# Altium project PLD.PrjPcb (part 2 of 2)

## Sheet PLD_SunSref-Interface.SchDoc: SunS Ref. Interface
size A4; ApprovedBy: Piotr Kuligowski; CheckedBy: Michal Gumiela; Author: Grzegorz Gajoch; DocumentNumber: PWSat2-xxx-DW-xxx; Revision: 1; SheetTotal: 32; Model: DM1
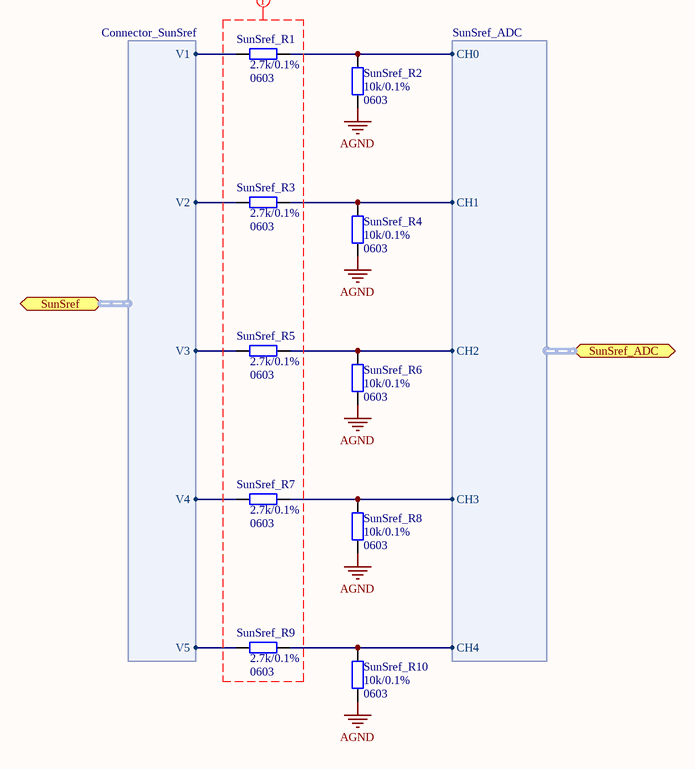
[diagram p16: PLD_SunSref-Interface.SchDoc]

### Parts
SunSref_R1  Package: 0603  [SMD_Resistor_0603]  (hidden comment: 2.7k/0.1%)
SunSref_R2  Package: 0603  [SMD_Resistor_0603]  (hidden comment: 10k/0.1%)
SunSref_R3  Package: 0603  [SMD_Resistor_0603]  (hidden comment: 2.7k/0.1%)
SunSref_R4  Package: 0603  [SMD_Resistor_0603]  (hidden comment: 10k/0.1%)
SunSref_R5  Package: 0603  [SMD_Resistor_0603]  (hidden comment: 2.7k/0.1%)
SunSref_R6  Package: 0603  [SMD_Resistor_0603]  (hidden comment: 10k/0.1%)
SunSref_R7  Package: 0603  [SMD_Resistor_0603]  (hidden comment: 2.7k/0.1%)
SunSref_R8  Package: 0603  [SMD_Resistor_0603]  (hidden comment: 10k/0.1%)
SunSref_R9  Package: 0603  [SMD_Resistor_0603]  (hidden comment: 2.7k/0.1%)
SunSref_R10  Package: 0603  [SMD_Resistor_0603]  (hidden comment: 10k/0.1%)

### Ports
SunSref (harness Connector_SunSref), SunSref_ADC (harness SunSref_ADC)

### Harnesses
Connector_SunSref: V1, V2, V3, V4, V5
SunSref_ADC: CH0, CH1, CH2, CH3, CH4

### Nets
AGND: SunSref_R2.1 SunSref_R4.1 SunSref_R6.1 SunSref_R8.1 SunSref_R10.1
NetADC_C1_1: SunSref_R1.2 SunSref_R2.2 ; port SunSref_ADC.CH0
NetADC_C2_1: SunSref_R9.2 SunSref_R10.2 ; port SunSref_ADC.CH4
NetADC_C3_1: SunSref_R3.2 SunSref_R4.2 ; port SunSref_ADC.CH1
NetADC_C4_1: SunSref_R7.2 SunSref_R8.2 ; port SunSref_ADC.CH3
NetADC_C6_1: SunSref_R5.2 SunSref_R6.2 ; port SunSref_ADC.CH2
NetCONN_H1_1: SunSref_R7.1 ; port SunSref.V4
NetCONN_H1_2: SunSref_R5.1 ; port SunSref.V3
NetCONN_H1_4: SunSref_R1.1 ; port SunSref.V1
NetCONN_H1_6: SunSref_R3.1 ; port SunSref.V2
NetCONN_H1_7: SunSref_R9.1 ; port SunSref.V5

### Layout directives
net class SunS-ref: (no net found under the mark)

### Notes on the sheet
- Title:
- Project:
- Author:
- Model:
- Document Number:
- Checked by:
- Rev:
- Date:
- Approved by:
- Sheet:
- of
- File name:

### Library data of the parts
SunSref_R1-SunSref_R10 = Res
  SunSref_R1 SunSref_R3 SunSref_R5 SunSref_R7 SunSref_R9: Value: 2.7k/0.1%
  SunSref_R2 SunSref_R4 SunSref_R6 SunSref_R8 SunSref_R10: Value: 10k/0.1%

## Sheet PLD_ADC.SchDoc: ADC for SunSref,Photodiodes and HK
size A4; ApprovedBy: Piotr Kuligowski; CheckedBy: Michal Gumiela; Author: Grzegorz Gajoch; DocumentNumber: PWSat2-xxx-DW-xxx; Revision: 1; SheetTotal: 32; Model: DM1
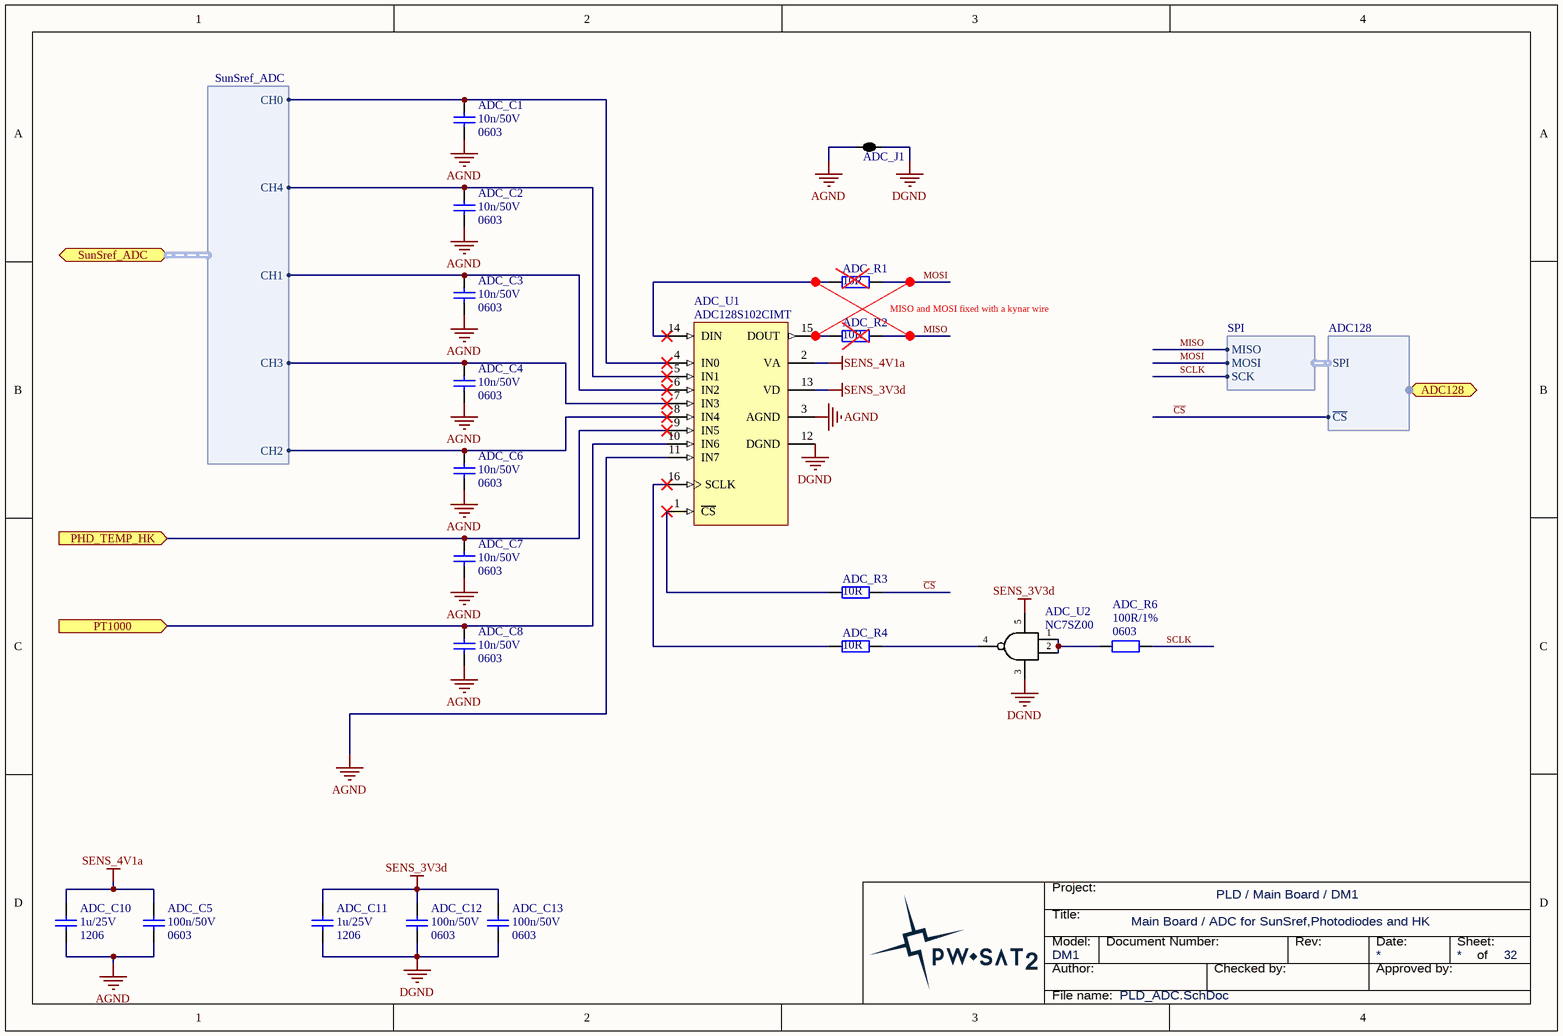
[diagram p17: PLD_ADC.SchDoc]

### Parts
ADC_C1  value 10n/50V  Package: 0603  [SMD_Capacitor_0603]  (hidden comment: Cap)
ADC_C2  value 10n/50V  Package: 0603  [SMD_Capacitor_0603]  (hidden comment: Cap)
ADC_C3  value 10n/50V  Package: 0603  [SMD_Capacitor_0603]  (hidden comment: Cap)
ADC_C4  value 10n/50V  Package: 0603  [SMD_Capacitor_0603]  (hidden comment: Cap)
ADC_C5  Package: 0603  [SMD_Capacitor_0603]  (hidden comment: 100n/50V)
ADC_C6  value 10n/50V  Package: 0603  [SMD_Capacitor_0603]  (hidden comment: Cap)
ADC_C7  value 10n/50V  Package: 0603  [SMD_Capacitor_0603]  (hidden comment: Cap)
ADC_C8  value 10n/50V  Package: 0603  [SMD_Capacitor_0603]  (hidden comment: Cap)
ADC_C10  Package: 1206  [SMD_Capacitor_1206]  (hidden comment: 1u/25V)
ADC_C11  Package: 1206  [SMD_Capacitor_1206]  (hidden comment: 1u/25V)
ADC_C12  Package: 0603  [SMD_Capacitor_0603]  (hidden comment: 100n/50V)
ADC_C13  Package: 0603  [SMD_Capacitor_0603]  (hidden comment: 100n/50V)
ADC_J1  2 way net tie junction  [2way_LP]  (value not drawn)  (net tie, no BOM)
ADC_R1  10R  [SMD_Resistor_0603]
ADC_R2  10R  [SMD_Resistor_0603]
ADC_R3  10R  [SMD_Resistor_0603]
ADC_R4  10R  [SMD_Resistor_0603]
ADC_R6  Package: 0603  [SMD_Resistor_0603]  (hidden comment: 100R/1%)
ADC_U1  ADC128S102CIMT  [TSSOP16]
ADC_U2  NC7SZ00  [SOT23-5]

### Ports
ADC128 (harness ADC128), PHD_TEMP_HK (in), PT1000 (in), SunSref_ADC (harness SunSref_ADC)

### Harnesses
SPI: MISO, MOSI, SCK
SunSref_ADC: CH0, CH1, CH2, CH3, CH4
ADC128: SPI, ~{CS}

### Nets
AGND: ADC_C1.2 ADC_C2.2 ADC_C3.2 ADC_C4.2 ADC_C5.2 ADC_C6.2 ADC_C7.2 ADC_C8.2 ADC_C10.2 ADC_J1.1 ADC_U1.3(AGND) ADC_U1.11(IN7)
DGND: ADC_C11.2 ADC_C12.2 ADC_C13.2 ADC_J1.2 ADC_U1.12(DGND) ADC_U2.3(GND)
SENS_3V3d: ADC_C11.1 ADC_C12.1 ADC_C13.1 ADC_U1.13(VD) ADC_U2.5(Vcc)
SENS_4V1a: ADC_C5.1 ADC_C10.1 ADC_U1.2(VA)
~{CS}: ADC_R3.2 ; port ADC128.~{CS}  [project net ADC128_~{CS}]
MISO: ADC_R2.2 ; harness SPI.MISO
MOSI: ADC_R1.2 ; harness SPI.MOSI
SCLK: ADC_R6.2 ; harness SPI.SCK  [project net SCK]
NetADC_C1_1: ADC_C1.1 ADC_U1.4(IN0) ; port SunSref_ADC.CH0
NetADC_C2_1: ADC_C2.1 ADC_U1.5(IN1) ; port SunSref_ADC.CH4
NetADC_C3_1: ADC_C3.1 ADC_U1.6(IN2) ; port SunSref_ADC.CH1
NetADC_C4_1: ADC_C4.1 ADC_U1.7(IN3) ; port SunSref_ADC.CH3
NetADC_C6_1: ADC_C6.1 ADC_U1.8(IN4) ; port SunSref_ADC.CH2
NetADC_C7_1: ADC_C7.1 ADC_U1.9(IN5) ; port PHD_TEMP_HK
NetADC_C8_1: ADC_C8.1 ADC_U1.10(IN6) ; port PT1000
NetADC_R1_1: ADC_R1.1 ADC_U1.14(DIN)
NetADC_R2_1: ADC_R2.1 ADC_U1.15(DOUT)
NetADC_R3_1: ADC_R3.1 ADC_U1.1(~{CS})
NetADC_R4_1: ADC_R4.1 ADC_U1.16(SCLK)
NetADC_R4_2: ADC_R4.2 ADC_U2.4(Y)
NetADC_R6_1: ADC_R6.1 ADC_U2.1(A) ADC_U2.2(B)

### Notes on the sheet
- MISO and MOSI fixed with a kynar wire
- Title:
- Project:
- Author:
- Model:
- Document Number:
- Checked by:
- Rev:
- Date:
- Approved by:
- Sheet:
- of
- File name:

### Library data of the parts
ADC_C5 ADC_C12 ADC_C13 = Cer_C0603T104K5RALTU: Ceramic Cap Kemet COTS 100n/50V X7R 0603; Manufacturer: Kemet; ManufacturerPartNumber: C0603T104K5RALTU; Value: 100n/50V
ADC_C10 ADC_C11 = Cer_C1206T105K3RALTU: Ceramic Cap Kemet COTS 1u/25V X7R 1206; ManufacturerPartNumber: C1206T105K3RALTU; Manufacturer: Kemet; Value: 1u/25V
ADC_J1 = 2way: ComponentLink1URL: http://www.edatools.cz/addons; ComponentLink1Description: Source; FootprintNote: LP=12mil, MP=40mil, HP=120mil
ADC_R1-ADC_R4 = Res: Value: 10R; Package: 0603
ADC_R6 = CRCW0603100RFKxxxx: 100R/1% Vishay CRCW 0603 Resistor. 100mW, 100ppm, 75V.; Manufacturer: Vishay; ManufacturerPartNumber: CRCW0603100RFKxxxx; Value: 100R/1%
ADC_U1 = ADC128S102CIMT: 8-Channel, 500-ksps to 1-Msps, 12-Bit A/D Converter; Manufacturer: Texas Instruments; Category: ADC; ManufacturerPartNumber: ADC128S102CIMT
ADC_U2 = NC7SZ00: TinyLogic UHS Two-Input NAND Gate.; Manufacturer: Fairchild Semiconductor; Value: NC7SZ00

## Sheet PLD_I2C-Repeater.SchDoc: I2C Repeater for RadFET
size A4; ApprovedBy: Piotr Kuligowski; CheckedBy: Michal Gumiela; Author: Grzegorz Gajoch; DocumentNumber: PWSat2-xxx-DW-xxx; Revision: 1; SheetTotal: 32; Model: DM1
Used 4 times, as channels PLD Top/I2C Repeater for PLD, PLD Top/I2C Repeater for RTC, PLD Top/I2C Repeater for SunS, PLD Top/I2C Repeater for Gyro. Parts and nets are listed once, with the designators drawn on the sheet.
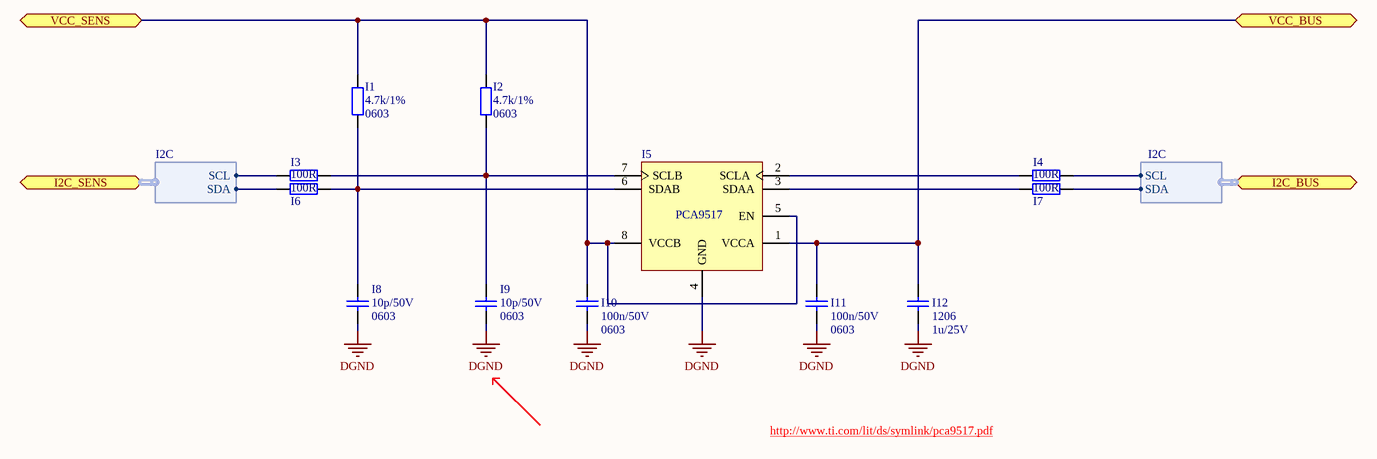
[diagram p18: PLD_I2C-Repeater.SchDoc]

### Parts
I1  Package: 0603  [SMD_Resistor_0603]  (hidden comment: 4.7k/1%)
I2  Package: 0603  [SMD_Resistor_0603]  (hidden comment: 4.7k/1%)
I3  100R  [SMD_Resistor_0603]
I4  100R  [SMD_Resistor_0603]
I5  PCA9517  [TSSOP8_L]
I6  100R  [SMD_Resistor_0603]
I7  100R  [SMD_Resistor_0603]
I8  Package: 0603  [SMD_Capacitor_0603]  (hidden comment: 10p/50V)
I9  Package: 0603  [SMD_Capacitor_0603]  (hidden comment: 10p/50V)
I10  Package: 0603  [SMD_Capacitor_0603]  (hidden comment: 100n/50V)
I11  Package: 0603  [SMD_Capacitor_0603]  (hidden comment: 100n/50V)
I12  Package: 1206  [SMD_Capacitor_1206]  (hidden comment: 1u/25V)

### Ports
I2C_BUS (harness I2C), I2C_SENS (harness I2C), VCC_BUS, VCC_SENS

### Harnesses
I2C: SDA, SCL

### Nets
DGND: I5.4(GND) I8.2 I9.2 I10.1 I11.1 I12.1
VCC_BUS: I5.1(VCCA) I11.2 I12.2 ; port VCC_BUS
VCC_SENS: I1.1 I2.1 I5.5(EN) I5.8(VCCB) I10.2 ; port VCC_SENS
NetI1_2: I1.2 I5.6(SDAB) I6.2 I8.1
NetI2_2: I2.2 I3.2 I5.7(SCLB) I9.1
NetI3_1: I3.1 ; port I2C_SENS.SCL
NetI4_1: I4.1 I5.2(SCLA)
NetI4_2: I4.2 ; port I2C_BUS.SCL
NetI5_3: I5.3(SDAA) I7.1
NetI6_1: I6.1 ; port I2C_SENS.SDA
NetI7_2: I7.2 ; port I2C_BUS.SDA

### Channels
PLD Top/I2C Repeater for PLD: designators end in _I2C_Repeater_for_PLD; ports VCC_BUS=OBC_PLD_3V3 VCC_SENS=SENS_3V3d
PLD Top/I2C Repeater for RTC: designators end in _I2C_Repeater_for_RTC; ports VCC_BUS=OBC_BUS_3V3 VCC_SENS=OBC_BUS_3V3
PLD Top/I2C Repeater for SunS: designators end in _I2C_Repeater_for_SunS; ports VCC_BUS=OBC_PLD_3V3 VCC_SENS=SunS_3V3
PLD Top/I2C Repeater for Gyro: designators end in _I2C_Repeater_for_Gyro; ports VCC_BUS=OBC_PLD_3V3 VCC_SENS=OBC_PLD_3V3

### Notes on the sheet
- http://www.ti.com/lit/ds/symlink/pca9517.pdf
- Title:
- Project:
- Author:
- Model:
- Document Number:
- Checked by:
- Rev:
- Date:
- Approved by:
- Sheet:
- of
- File name:

### Library data of the parts
I1 I2 = CRCW06034K70FKxxxx: 4.7k/1% Vishay CRCW 0603 Resistor. 100mW, 100ppm, 75V.; Manufacturer: Vishay; ManufactuerPartNumber: CRCW06034K70FKxxxx; Value: 4.7k/1%
I3 I4 I6 I7 = Res: Value: 100R; Package: 0603
I5 = PCA9517: Level-Translating I2C Bus Repeater; Manufacturer: Texas Instruments; ManufacturerPartNumber: PCA9517
I8 I9 = Cer_GCM1885C1H100JA16D: Ceramic Cap Murata Automotive 10p/50V C0G 0603; Manufacturer: Murata; ManufacturerPartNumber: GCM1885C1H100JA16D; Value: 10p/50V
I10 I11 = Cer_C0603T104K5RALTU: Ceramic Cap Kemet COTS 100n/50V X7R 0603; Manufacturer: Kemet; ManufacturerPartNumber: C0603T104K5RALTU; Value: 100n/50V
I12 = Cer_C1206T105K3RALTU: Ceramic Cap Kemet COTS 1u/25V X7R 1206; ManufacturerPartNumber: C1206T105K3RALTU; Manufacturer: Kemet; Value: 1u/25V

## Sheet PLD_Gyroscopes.SchDoc: Gyroscopes
size A4; ApprovedBy: Piotr Kuligowski; CheckedBy: Michal Gumiela; Author: Grzegorz Gajoch; DocumentNumber: PWSat2-xxx-DW-xxx; Revision: 1; SheetTotal: 32; Model: DM1
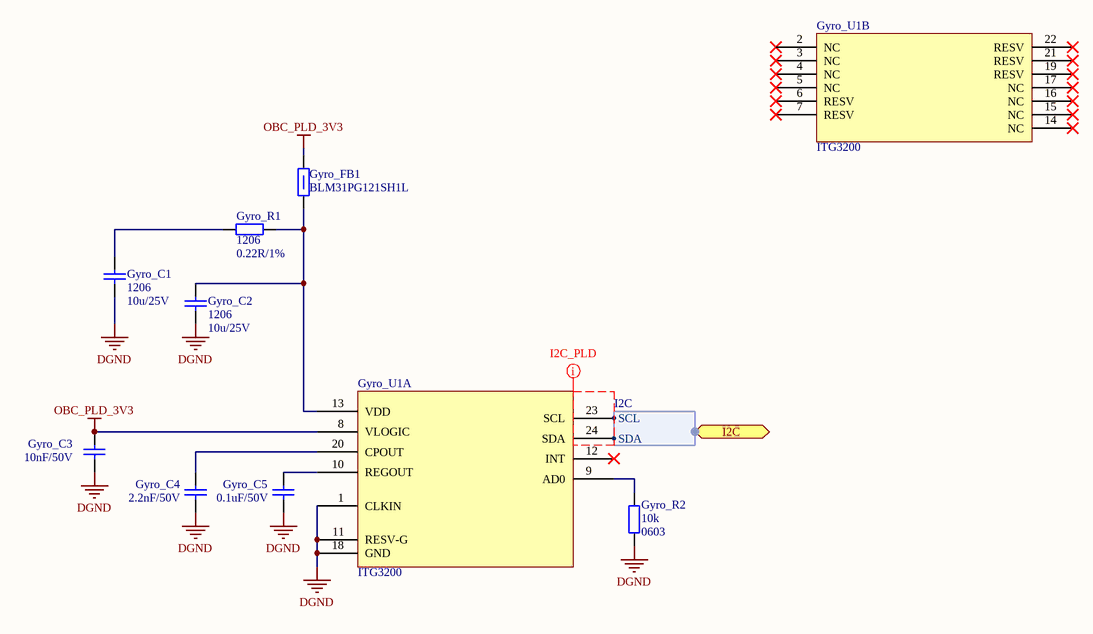
[diagram p19: PLD_Gyroscopes.SchDoc]

### Parts
Gyro_C1  Package: 1206  [SMD_Capacitor_1206]  (hidden comment: 10u/25V)
Gyro_C2  Package: 1206  [SMD_Capacitor_1206]  (hidden comment: 10u/25V)
Gyro_C3  10nF/50V  [SMD_Capacitor_0603]
Gyro_C4  2.2nF/50V  [SMD_Capacitor_0603]
Gyro_C5  0.1uF/50V  [SMD_Capacitor_0603]
Gyro_FB1  120R/100MHz  [SMD_FerriteBead_1206]  (value not drawn)
Gyro_R1  Package: 1206  [SMD_Resistor_1206]  (hidden comment: 0.22R/1%)
Gyro_R2  10k  Package: 0603  [SMD_Resistor_0603]
Gyro_U1  ITG3200  [QFN24_4x4]  (parts A,B of 2)

### Ports
I2C (harness I2C)

### Harnesses
I2C: SDA, SCL

### Nets
DGND: Gyro_C1.2 Gyro_C2.2 Gyro_C3.2 Gyro_C4.2 Gyro_C5.2 Gyro_R2.2 Gyro_U1.1(CLKIN) Gyro_U1.11(RESV-G) Gyro_U1.18(GND)
OBC_PLD_3V3: Gyro_C3.1 Gyro_FB1.1 Gyro_U1.8(VLOGIC)
NetGyro_C1_1: Gyro_C1.1 Gyro_R1.1
NetGyro_C2_1: Gyro_C2.1 Gyro_FB1.2 Gyro_R1.2 Gyro_U1.13(VDD)
NetGyro_C4_1: Gyro_C4.1 Gyro_U1.20(CPOUT)
NetGyro_C5_1: Gyro_C5.1 Gyro_U1.10(REGOUT)
NetGyro_R2_1: Gyro_R2.1 Gyro_U1.9(AD0)
NetGyro_U1_23: Gyro_U1.23(SCL) ; port I2C.SCL
NetGyro_U1_24: Gyro_U1.24(SDA) ; port I2C.SDA

Not connected (* = marked no-connect by the designer): Gyro_U1 2(NC)* 3(NC)* 4(NC)* 5(NC)* 6(RESV)* 7(RESV)* 12(INT)* 14(NC)* 15(NC)* 16(NC)* 17(NC)* 19(RESV)* 21(RESV)* 22(RESV)*

### Layout directives
net class I2C_PLD: (no net found under the mark)

### Notes on the sheet
- Title:
- Project:
- Author:
- Model:
- Document Number:
- Checked by:
- Rev:
- Date:
- Approved by:
- Sheet:
- of
- File name:

### Library data of the parts
Gyro_C1 Gyro_C2 = Cer_C1206T105K3RALTU: Ceramic Cap Kemet COTS 1u/25V X7R 1206; ManufacturerPartNumber: C1206T105K3RALTU; Manufacturer: Kemet; Value: 10u/25V
Gyro_C3-Gyro_C5 = Cer_C0603T104K5RALTU: Ceramic Cap Kemet COTS 100n/50V X7R 0603; Manufacturer: Kemet; ManufacturerPartNumber: C0603T104K5RALTU; Package: 0603
  Gyro_C3: Value: 10nF/50V
  Gyro_C4: Value: 2.2nF/50V
  Gyro_C5: Value: 0.1uF/50V
Gyro_FB1 = BLM31PG121SH1L: Ferrite bead, 1206, 0.02HM, 3.5A.; Manufacturer: Murata; Current Rating: 3.5A; Series Resistance DC: 0.02R; Package: 1206; Value: 120R/100MHz; ManufacturerPartNumber: BLM31PG121SH1L
Gyro_R1 = ERJ-8BQFR22V: Panasonic Resistor 0.22R 1% 1206 330mW; Manufacturer: Panasonic; ManufacturerPartNumber: ERJ-8BQFR22V; Value: 0.22R/1%
Gyro_R2 = Res: Value: Res

## Sheet PLD_Local-Supply.SchDoc: Local Supply
size A3; ApprovedBy: Piotr Kuligowski; CheckedBy: Michal Gumiela; Author: Grzegorz Gajoch; DocumentNumber: PWSat2-xxx-DW-xxx; Revision: 1; SheetTotal: 32; Model: DM1
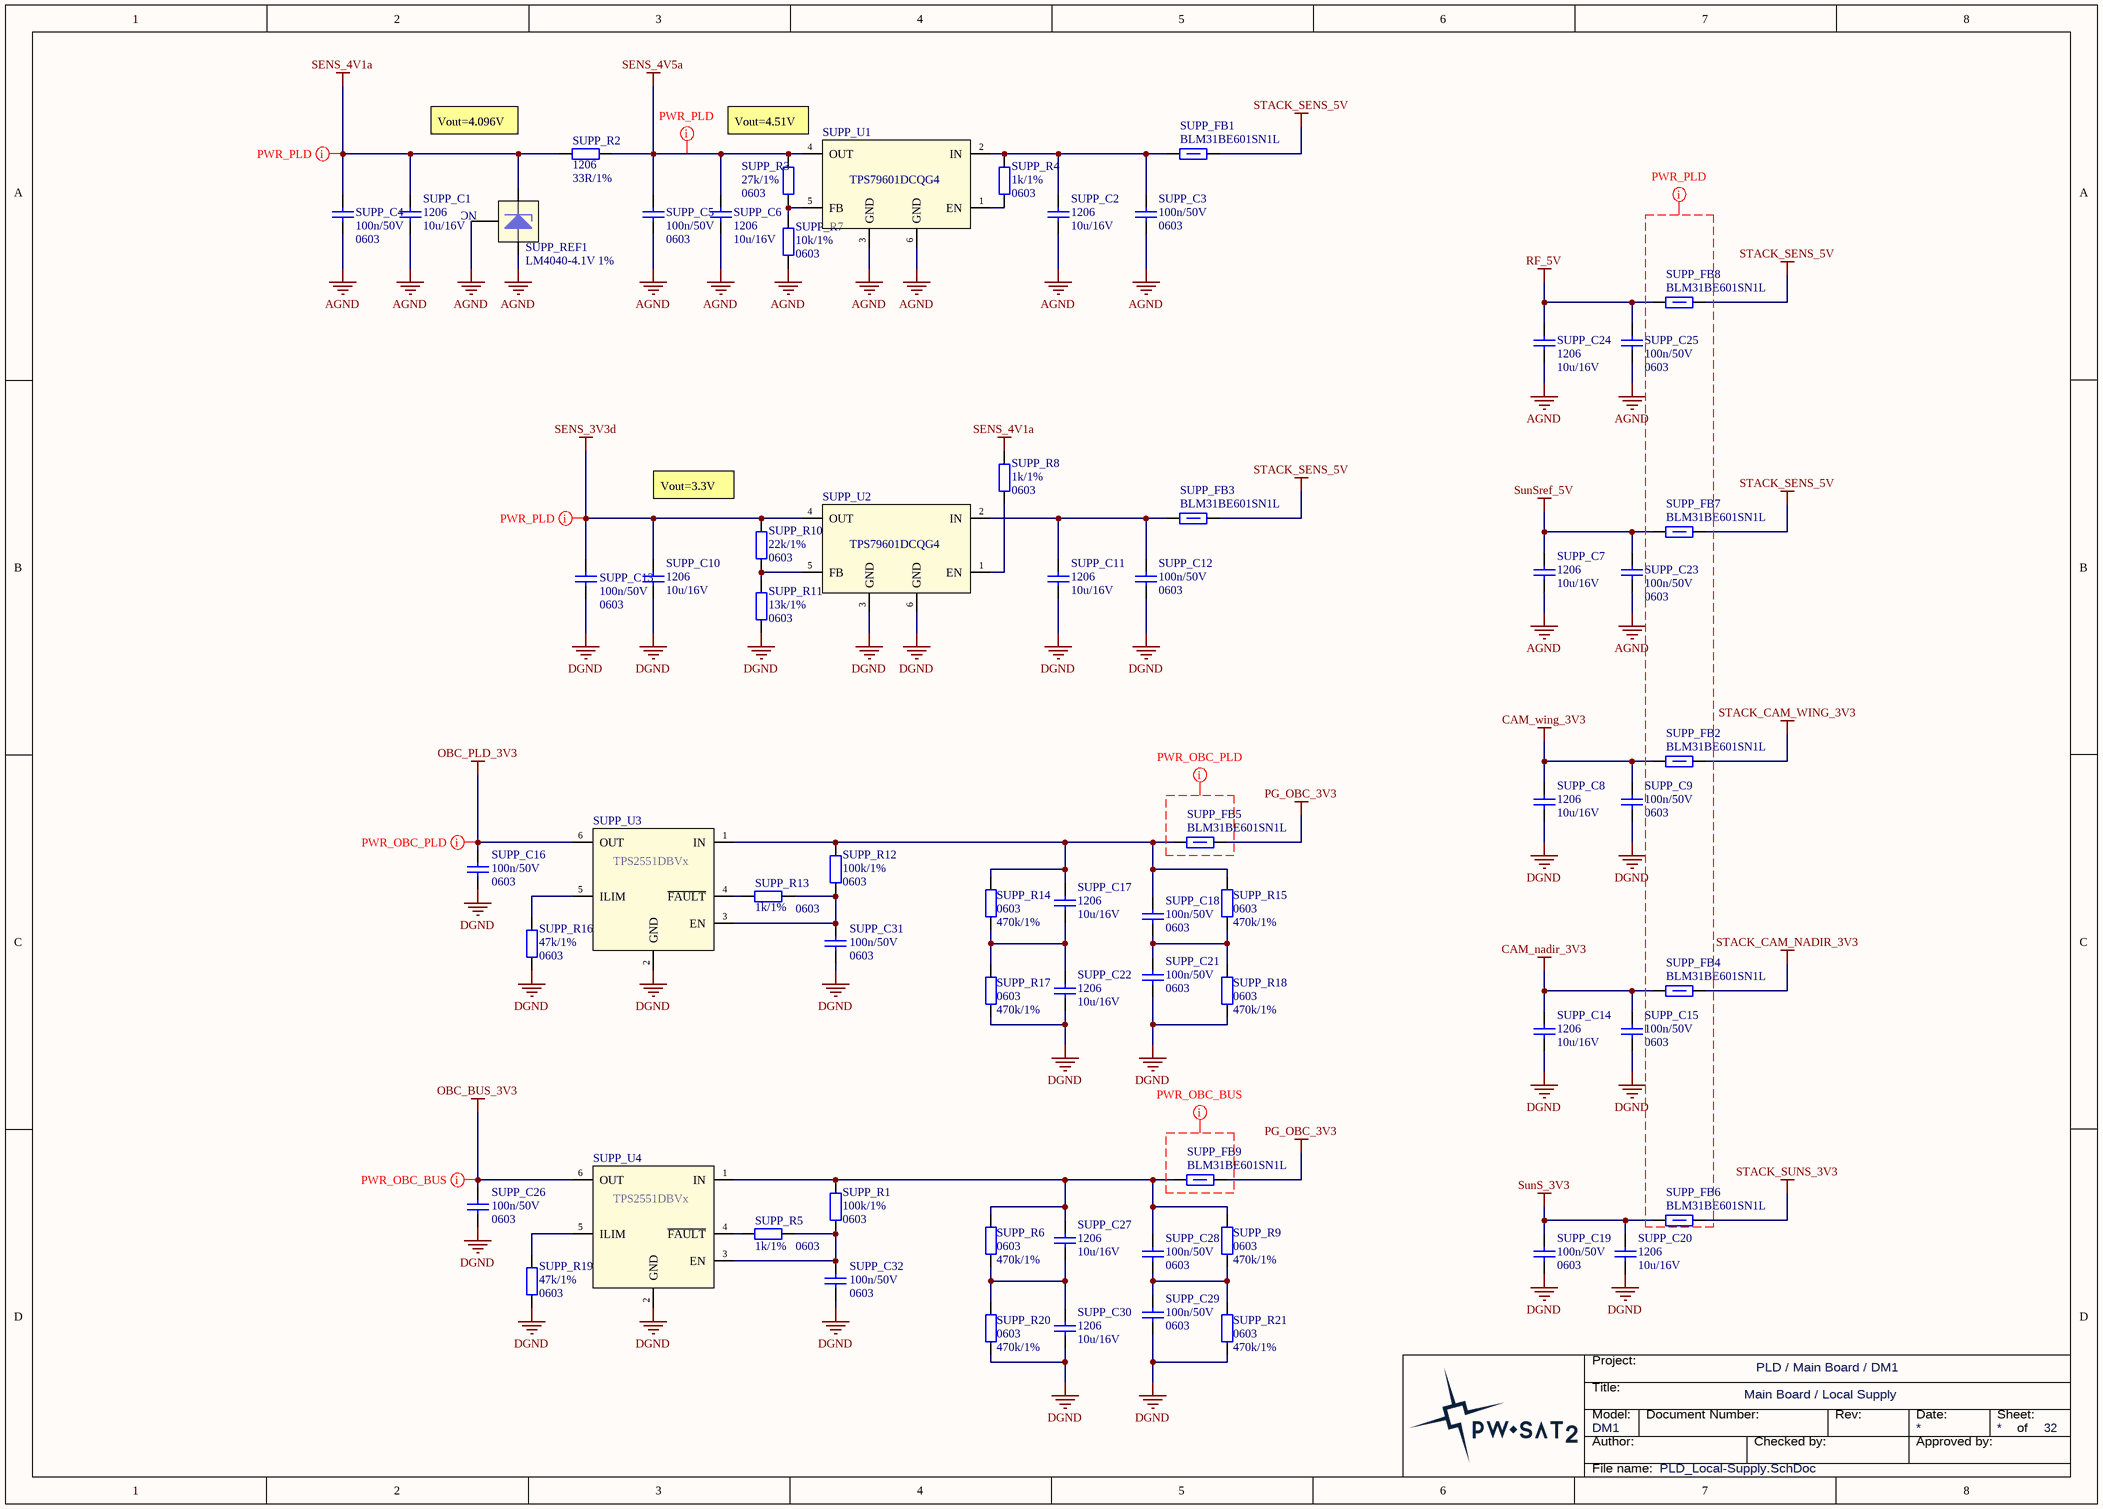
[diagram p20: PLD_Local-Supply.SchDoc]

### Parts
SUPP_C1  Packge: 1206  [SMD_Capacitor_1206]  (hidden comment: 10u/16V)
SUPP_C2  Packge: 1206  [SMD_Capacitor_1206]  (hidden comment: 10u/16V)
SUPP_C3  Package: 0603  [SMD_Capacitor_0603]  (hidden comment: 100n/50V)
SUPP_C4  Package: 0603  [SMD_Capacitor_0603]  (hidden comment: 100n/50V)
SUPP_C5  Package: 0603  [SMD_Capacitor_0603]  (hidden comment: 100n/50V)
SUPP_C6  Packge: 1206  [SMD_Capacitor_1206]  (hidden comment: 10u/16V)
SUPP_C7  Packge: 1206  [SMD_Capacitor_1206]  (hidden comment: 10u/16V)
SUPP_C8  Packge: 1206  [SMD_Capacitor_1206]  (hidden comment: 10u/16V)
SUPP_C9  Package: 0603  [SMD_Capacitor_0603]  (hidden comment: 100n/50V)
SUPP_C10  Packge: 1206  [SMD_Capacitor_1206]  (hidden comment: 10u/16V)
SUPP_C11  Packge: 1206  [SMD_Capacitor_1206]  (hidden comment: 10u/16V)
SUPP_C12  Package: 0603  [SMD_Capacitor_0603]  (hidden comment: 100n/50V)
SUPP_C13  Package: 0603  [SMD_Capacitor_0603]  (hidden comment: 100n/50V)
SUPP_C14  Packge: 1206  [SMD_Capacitor_1206]  (hidden comment: 10u/16V)
SUPP_C15  Package: 0603  [SMD_Capacitor_0603]  (hidden comment: 100n/50V)
SUPP_C16  Package: 0603  [SMD_Capacitor_0603]  (hidden comment: 100n/50V)
SUPP_C17  Packge: 1206  [SMD_Capacitor_1206]  (hidden comment: 10u/16V)
SUPP_C18  Package: 0603  [SMD_Capacitor_0603]  (hidden comment: 100n/50V)
SUPP_C19  Package: 0603  [SMD_Capacitor_0603]  (hidden comment: 100n/50V)
SUPP_C20  Packge: 1206  [SMD_Capacitor_1206]  (hidden comment: 10u/16V)
SUPP_C21  Package: 0603  [SMD_Capacitor_0603]  (hidden comment: 100n/50V)
SUPP_C22  Packge: 1206  [SMD_Capacitor_1206]  (hidden comment: 10u/16V)
SUPP_C23  Package: 0603  [SMD_Capacitor_0603]  (hidden comment: 100n/50V)
SUPP_C24  Packge: 1206  [SMD_Capacitor_1206]  (hidden comment: 10u/16V)
SUPP_C25  Package: 0603  [SMD_Capacitor_0603]  (hidden comment: 100n/50V)
SUPP_C26  Package: 0603  [SMD_Capacitor_0603]  (hidden comment: 100n/50V)
SUPP_C27  Packge: 1206  [SMD_Capacitor_1206]  (hidden comment: 10u/16V)
SUPP_C28  Package: 0603  [SMD_Capacitor_0603]  (hidden comment: 100n/50V)
SUPP_C29  Package: 0603  [SMD_Capacitor_0603]  (hidden comment: 100n/50V)
SUPP_C30  Packge: 1206  [SMD_Capacitor_1206]  (hidden comment: 10u/16V)
SUPP_C31  Package: 0603  [SMD_Capacitor_0603]  (hidden comment: 100n/50V)
SUPP_C32  Package: 0603  [SMD_Capacitor_0603]  (hidden comment: 100n/50V)
SUPP_FB1  ManufacturerPartNumber: BLM31BE601SN1L  [1206]  (hidden comment: 600R/100MHz)
SUPP_FB2  ManufacturerPartNumber: BLM31BE601SN1L  [1206]  (hidden comment: 600R/100MHz)
SUPP_FB3  ManufacturerPartNumber: BLM31BE601SN1L  [1206]  (hidden comment: 600R/100MHz)
SUPP_FB4  ManufacturerPartNumber: BLM31BE601SN1L  [1206]  (hidden comment: 600R/100MHz)
SUPP_FB5  ManufacturerPartNumber: BLM31BE601SN1L  [1206]  (hidden comment: 600R/100MHz)
SUPP_FB6  ManufacturerPartNumber: BLM31BE601SN1L  [1206]  (hidden comment: 600R/100MHz)
SUPP_FB7  ManufacturerPartNumber: BLM31BE601SN1L  [1206]  (hidden comment: 600R/100MHz)
SUPP_FB8  ManufacturerPartNumber: BLM31BE601SN1L  [1206]  (hidden comment: 600R/100MHz)
SUPP_FB9  ManufacturerPartNumber: BLM31BE601SN1L  [1206]  (hidden comment: 600R/100MHz)
SUPP_R1  Package: 0603  [SMD_Resistor_0603]  (hidden comment: 100k/1%)
SUPP_R2  Package: 1206  [SMD_Resistor_1206]  (hidden comment: 33R/1%)
SUPP_R3  Package: 0603  [SMD_Resistor_0603]  (hidden comment: 27k/1%)
SUPP_R4  Package: 0603  [SMD_Resistor_0603]  (hidden comment: 1k/1%)
SUPP_R5  Package: 0603  [SMD_Resistor_0603]  (hidden comment: 1k/1%)
SUPP_R6  Package: 0603  [SMD_Resistor_0603]  (hidden comment: 470k/1%)
SUPP_R7  Package: 0603  [SMD_Resistor_0603]  (hidden comment: 10k/1%)
SUPP_R8  Package: 0603  [SMD_Resistor_0603]  (hidden comment: 1k/1%)
SUPP_R9  Package: 0603  [SMD_Resistor_0603]  (hidden comment: 470k/1%)
SUPP_R10  Package: 0603  [SMD_Resistor_0603]  (hidden comment: 22k/1%)
SUPP_R11  Package: 0603  [SMD_Resistor_0603]  (hidden comment: 13k/1%)
SUPP_R12  Package: 0603  [SMD_Resistor_0603]  (hidden comment: 100k/1%)
SUPP_R13  Package: 0603  [SMD_Resistor_0603]  (hidden comment: 1k/1%)
SUPP_R14  Package: 0603  [SMD_Resistor_0603]  (hidden comment: 470k/1%)
SUPP_R15  Package: 0603  [SMD_Resistor_0603]  (hidden comment: 470k/1%)
SUPP_R16  Package: 0603  [SMD_Resistor_0603]  (hidden comment: 47k/1%)
SUPP_R17  Package: 0603  [SMD_Resistor_0603]  (hidden comment: 470k/1%)
SUPP_R18  Package: 0603  [SMD_Resistor_0603]  (hidden comment: 470k/1%)
SUPP_R19  Package: 0603  [SMD_Resistor_0603]  (hidden comment: 47k/1%)
SUPP_R20  Package: 0603  [SMD_Resistor_0603]  (hidden comment: 470k/1%)
SUPP_R21  Package: 0603  [SMD_Resistor_0603]  (hidden comment: 470k/1%)
SUPP_REF1  LM4040-4.1V 1%  [SOT23-3]
SUPP_U1  (no value)  [TI-DCQ]
SUPP_U2  (no value)  [TI-DCQ]
SUPP_U3  TPS2551DBVx  [SOT23-6]
SUPP_U4  TPS2551DBVx  [SOT23-6]

### Nets
AGND: SUPP_C1.2 SUPP_C2.2 SUPP_C3.2 SUPP_C4.2 SUPP_C5.2 SUPP_C6.2 SUPP_C7.2 SUPP_C23.1 SUPP_C24.2 SUPP_C25.1 SUPP_R7.2 SUPP_REF1.2(A) SUPP_REF1.3(NC) SUPP_U1.3(GND) SUPP_U1.6(GND)
CAM_nadir_3V3: SUPP_C14.1 SUPP_C15.1 SUPP_FB4.2
CAM_wing_3V3: SUPP_C8.1 SUPP_C9.1 SUPP_FB2.2
DGND: SUPP_C8.2 SUPP_C9.2 SUPP_C10.2 SUPP_C11.2 SUPP_C12.2 SUPP_C13.2 SUPP_C14.2 SUPP_C15.2 SUPP_C16.1 SUPP_C19.2 SUPP_C20.2 SUPP_C21.2 SUPP_C22.2 SUPP_C26.1 SUPP_C29.2 SUPP_C30.2 SUPP_C31.1 SUPP_C32.1 SUPP_R11.2 SUPP_R16.2 SUPP_R17.2 SUPP_R18.2 SUPP_R19.2 SUPP_R20.2 SUPP_R21.2 SUPP_U2.3(GND) SUPP_U2.6(GND) SUPP_U3.2(GND) SUPP_U4.2(GND)
OBC_BUS_3V3: SUPP_C26.2 SUPP_U4.6(OUT)
OBC_PLD_3V3: SUPP_C16.2 SUPP_U3.6(OUT)
PG_OBC_3V3: SUPP_FB5.1 SUPP_FB9.1
RF_5V: SUPP_C24.1 SUPP_C25.2 SUPP_FB8.2
SENS_3V3d: SUPP_C10.1 SUPP_C13.1 SUPP_R10.1 SUPP_U2.4(OUT)
SENS_4V1a: SUPP_C1.1 SUPP_C4.1 SUPP_R2.1 SUPP_R8.1 SUPP_REF1.1(K)
SENS_4V5a: SUPP_C5.1 SUPP_C6.1 SUPP_R2.2 SUPP_R3.1 SUPP_U1.4(OUT)
STACK_CAM_NADIR_3V3: SUPP_FB4.1
STACK_CAM_WING_3V3: SUPP_FB2.1
STACK_SENS_5V: SUPP_FB1.1 SUPP_FB3.1 SUPP_FB7.1 SUPP_FB8.1
STACK_SUNS_3V3: SUPP_FB6.1
SunS_3V3: SUPP_C19.1 SUPP_C20.1 SUPP_FB6.2
SunSref_5V: SUPP_C7.1 SUPP_C23.2 SUPP_FB7.2
NetSUPP_C2_1: SUPP_C2.1 SUPP_C3.1 SUPP_FB1.2 SUPP_R4.1 SUPP_U1.2(IN)
NetSUPP_C11_1: SUPP_C11.1 SUPP_C12.1 SUPP_FB3.2 SUPP_U2.2(IN)
NetSUPP_C17_1: SUPP_C17.1 SUPP_C18.1 SUPP_FB5.2 SUPP_R12.1 SUPP_R14.1 SUPP_R15.1 SUPP_U3.1(IN)
NetSUPP_C17_2: SUPP_C17.2 SUPP_C22.1 SUPP_R14.2 SUPP_R17.1
NetSUPP_C18_2: SUPP_C18.2 SUPP_C21.1 SUPP_R15.2 SUPP_R18.1
NetSUPP_C27_1: SUPP_C27.1 SUPP_C28.1 SUPP_FB9.2 SUPP_R1.1 SUPP_R6.1 SUPP_R9.1 SUPP_U4.1(IN)
NetSUPP_C27_2: SUPP_C27.2 SUPP_C30.1 SUPP_R6.2 SUPP_R20.1
NetSUPP_C28_2: SUPP_C28.2 SUPP_C29.1 SUPP_R9.2 SUPP_R21.1
NetSUPP_C31_2: SUPP_C31.2 SUPP_R12.2 SUPP_R13.2 SUPP_U3.3(EN)
NetSUPP_C32_2: SUPP_C32.2 SUPP_R1.2 SUPP_R5.2 SUPP_U4.3(EN)
NetSUPP_R3_2: SUPP_R3.2 SUPP_R7.1 SUPP_U1.5(FB)
NetSUPP_R4_2: SUPP_R4.2 SUPP_U1.1(EN)
NetSUPP_R5_1: SUPP_R5.1 SUPP_U4.4(~{FAULT})
NetSUPP_R8_2: SUPP_R8.2 SUPP_U2.1(EN)
NetSUPP_R10_2: SUPP_R10.2 SUPP_R11.1 SUPP_U2.5(FB)
NetSUPP_R13_1: SUPP_R13.1 SUPP_U3.4(~{FAULT})
NetSUPP_R16_1: SUPP_R16.1 SUPP_U3.5(ILIM)
NetSUPP_R19_1: SUPP_R19.1 SUPP_U4.5(ILIM)

### Layout directives
net class PWR_OBC_PLD: (no net found under the mark), OBC_PLD_3V3
net class PWR_PLD: (no net found under the mark), SENS_3V3d, SENS_4V1a, SENS_4V5a
net class PWR_OBC_BUS: (no net found under the mark), OBC_BUS_3V3

### Notes on the sheet
- Vout=4.096V
- Vout=4.51V
- (near SUPP_R10) Vout=3.3V
- Title:
- Project:
- Author:
- Model:
- Document Number:
- Checked by:
- Rev:
- Date:
- Approved by:
- Sheet:
- of
- File name:

### Library data of the parts
SUPP_C1 SUPP_C2 SUPP_C6-SUPP_C8 SUPP_C10 SUPP_C11 SUPP_C14 SUPP_C17 SUPP_C20 SUPP_C22 SUPP_C24 SUPP_C27 SUPP_C30 = Cer_C1206T106K4RACTU: Ceramic Cap Kemet COTS 10u/16V X7R 1206; ManufacturerPartNumber: C1206T106K4RACTU; Manufacturer: Kemet; Value: 10u/16V
SUPP_C3-SUPP_C5 SUPP_C9 SUPP_C12 SUPP_C13 SUPP_C15 SUPP_C16 SUPP_C18 SUPP_C19 SUPP_C21 SUPP_C23 SUPP_C25 SUPP_C26 SUPP_C28 SUPP_C29 SUPP_C31 SUPP_C32 = Cer_C0603T104K5RALTU: Ceramic Cap Kemet COTS 100n/50V X7R 0603; Manufacturer: Kemet; ManufacturerPartNumber: C0603T104K5RALTU; Value: 100n/50V
SUPP_FB1-SUPP_FB9 = FerriteBead: Ferrite Bead; Manufacturer: Murata; HelpUrl: http://www.mouser.com/ds/2/281/c31e-794748.pdf; Supplier 1: Mouser; Value: 600R/100MHz; Mouser: 81-BLM31B601S
SUPP_R1 SUPP_R12 = CRCW0603100KFKxxxx: 100k/1% Vishay CRCW 0603 Resistor. 100mW, 100ppm, 75V.; Manufacturer: Vishay; ManufacturerPartNumber: CRCW0603100KFKxxxx; Value: 100k/1%
SUPP_R2 = CRCW120633R0FKxxxx: 33R/1% Vishay CRCW 1206 Resistor. 250mW, 100ppm, 200V.; ManufacturerPartNumber: CRCW120633R0FKxxxx; Manufacturer: Vishay; Value: 33R/1%
SUPP_R3 SUPP_R10 SUPP_R11 = Res
  SUPP_R3: Value: 27k/1%
  SUPP_R10: Value: 22k/1%
  SUPP_R11: Value: 13k/1%
SUPP_R4 SUPP_R5 SUPP_R8 SUPP_R13 = CRCW06031K00FKxxxx: 1k/1% Vishay CRCW 0603 Resistor. 100mW, 100ppm, 75V.; Manufacturer: Vishay; ManufacturerPartNumber: CRCW06031K00FKxxxx; Value: 1k/1%
SUPP_R6 SUPP_R9 SUPP_R14 SUPP_R15 SUPP_R17 SUPP_R18 SUPP_R20 SUPP_R21 = CRCW0603470KFKxxxx: 470k/1% Vishay CRCW 0603 Resistor. 100mW, 100ppm, 75V.; Manufacturer: Vishay; ManufacturerPartNumber: CRCW0603470KFKxxxx; Value: 470k/1%
SUPP_R7 = CRCW060310K0FKxxxx: 10k/1% Vishay CRCW 0603 Resistor. 100mW, 100ppm, 75V.; Manufacturer: Vishay; ManufacturerPartNumber: CRCW060310K0FKxxxx; Value: 10k/1%
SUPP_R16 SUPP_R19 = CRCW060347K0FKxxxx: 47k/1% Vishay CRCW 0603 Resistor. 100mW, 100ppm, 75V.; Manufacturer: Vishay; ManufacturerPartNumber: CRCW060347K0FKxxxx; Value: 47k/1%
SUPP_REF1 = LM4040CIM3-4.1: Shunt V-REF, 4.096V, 1%, SOT23-3; Manufacturer: Texas Instruments; ManufacturerPartNumber: LM4040CIM3-4.1; HelpUrl: http://www.ti.com/lit/ds/symlink/lm4040-n.pdf; Value: LM4040-4.1V 1%
SUPP_U1 SUPP_U2 = TPS79601DCQG4: 1A, Ajdustable LDO, Ultralow-Noise, High PSRR, Fast, RF; Manufacturer: Texas Instruments; ManufacturerPartNumber: TPS79601DCQG4; HelpUrl: http://www.ti.com/lit/ds/slvs351p/slvs351p.pdf
SUPP_U3 SUPP_U4 = TPS2551DBVx: Adjustable Current-Limited Power-Distribution Switch.; Manufacturer: Texas Instruments; Value: TPS2551DBVx

## Sheet PLD_LMT87.SchDoc: LM60
size A4; ApprovedBy: Piotr Kuligowski; CheckedBy: Michal Gumiela; Author: Grzegorz Gajoch; DocumentNumber: PWSat2-xxx-DW-xxx; Revision: 1; SheetTotal: 32; Model: DM1
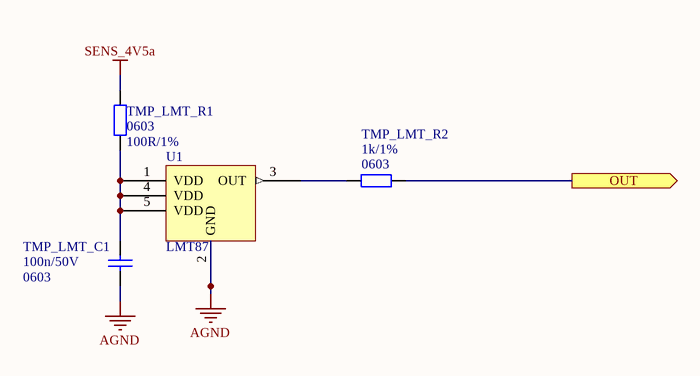
[diagram p21: PLD_LMT87.SchDoc]

### Parts
TMP_LMT_C1  Package: 0603  [SMD_Capacitor_0603]  (hidden comment: 100n/50V)
TMP_LMT_R1  Package: 0603  [SMD_Resistor_0603]  (hidden comment: 100R/1%)
TMP_LMT_R2  Package: 0603  [SMD_Resistor_0603]  (hidden comment: 1k/1%)
U1  LMT87  [SC70-LT5_N]

### Ports
OUT (out)

### Nets
AGND: TMP_LMT_C1.2 U1.2(GND)
SENS_4V5a: TMP_LMT_R1.2
LMT87_SUPPLY: TMP_LMT_R2.2 ; port OUT
NetTMP_LMT_C1_1: TMP_LMT_C1.1 TMP_LMT_R1.1 U1.1(VDD) U1.4(VDD) U1.5(VDD)
NetTMP_LMT_R2_1: TMP_LMT_R2.1 U1.3(OUT)

### Notes on the sheet
- Title:
- Project:
- Author:
- Model:
- Document Number:
- Checked by:
- Rev:
- Date:
- Approved by:
- Sheet:
- of
- File name:

### Library data of the parts
TMP_LMT_C1 = Cer_C0603T104K5RALTU: Ceramic Cap Kemet COTS 100n/50V X7R 0603; Manufacturer: Kemet; ManufacturerPartNumber: C0603T104K5RALTU; Value: 100n/50V
TMP_LMT_R1 = CRCW0603100RFKxxxx: 100R/1% Vishay CRCW 0603 Resistor. 100mW, 100ppm, 75V.; Manufacturer: Vishay; ManufacturerPartNumber: CRCW0603100RFKxxxx; Value: 100R/1%
TMP_LMT_R2 = CRCW06031K00FKxxxx: as SUPP_R4 on sheet PLD_Local-Supply; Manufacturer: Vishay; ManufacturerPartNumber: CRCW06031K00FKxxxx; Value: 1k/1%
U1 = LMT87: Analog Temperature Sensors with Class-AB Output

## Sheet PLD_Thermometers_PT1000.SchDoc: Thermometers
size A4; ApprovedBy: Piotr Kuligowski; CheckedBy: Michal Gumiela; Author: Grzegorz Gajoch; DocumentNumber: PWSat2-xxx-DW-xxx; Revision: 1; SheetTotal: 32; Model: DM1
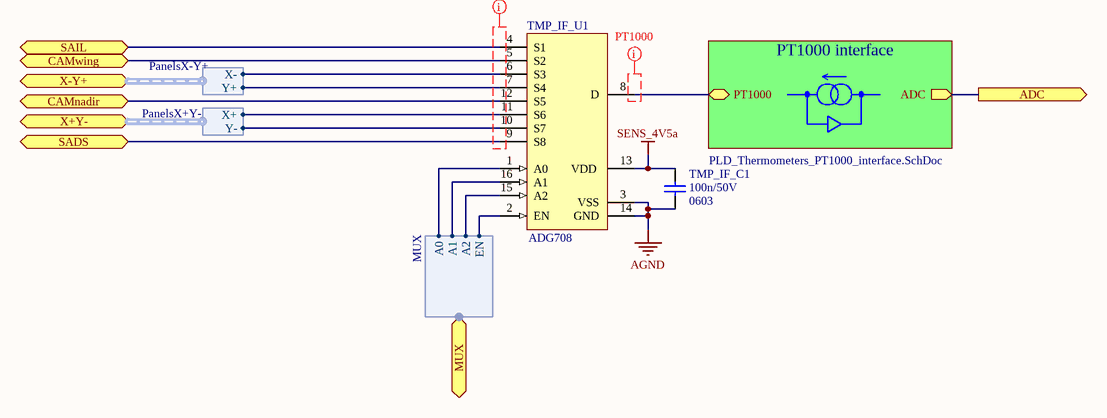
[diagram p22: PLD_Thermometers_PT1000.SchDoc]

### Parts
TMP_IF_C1  Package: 0603  [SMD_Capacitor_0603]  (hidden comment: 100n/50V)
TMP_IF_U1  ADG708  [TSSOP16]

### Sub-sheets
PT1000 interface = PLD_Thermometers_PT1000_interface.SchDoc (file not in this document): ADC (out), PT1000 (bidir)

### Ports
ADC (out), CAMnadir, CAMwing, MUX (harness MUX), SADS, SAIL, X+Y- (harness PanelsX+Y-), X-Y+ (harness PanelsX-Y+)

### Harnesses
MUX: A0, A1, A2, EN
PanelsX+Y-: X+, Y-
PanelsX-Y+: X-, Y+

### Nets
AGND: TMP_IF_C1.2 TMP_IF_U1.3(VSS) TMP_IF_U1.14(GND)
SENS_4V5a: TMP_IF_C1.1 TMP_IF_U1.13(VDD)
A0: TMP_IF_U1.1(A0) ; port MUX.A0
A1: TMP_IF_U1.16(A1) ; port MUX.A1
A2: TMP_IF_U1.15(A2) ; port MUX.A2
EN: TMP_IF_U1.2(EN) ; port MUX.EN
PT1000_SADS: TMP_IF_U1.9(S8) ; port SADS
PT1000_SAIL: TMP_IF_U1.4(S1) ; port SAIL
NetADC_C8_1: port ADC, sheet PT1000 interface/ADC
NetCONN_H3_6: TMP_IF_U1.5(S2) ; port CAMwing
NetCONN_H4_5: TMP_IF_U1.10(S7) ; port X+Y-.Y-
NetCONN_H4_7: TMP_IF_U1.11(S6) ; port X+Y-.X+
NetCONN_H5_6: TMP_IF_U1.12(S5) ; port CAMnadir
NetCONN_H6_6: TMP_IF_U1.7(S4) ; port X-Y+.Y+
NetCONN_H6_8: TMP_IF_U1.6(S3) ; port X-Y+.X-
NetTMP_IF_U1_8: TMP_IF_U1.8(D) ; sheet PT1000 interface/PT1000

### Layout directives
net class PT1000: (no net found under the mark)

### Notes on the sheet
- Title:
- Project:
- Author:
- Model:
- Document Number:
- Checked by:
- Rev:
- Date:
- Approved by:
- Sheet:
- of
- File name:

### Library data of the parts
TMP_IF_C1 = Cer_C0603T104K5RALTU: Ceramic Cap Kemet COTS 100n/50V X7R 0603; Manufacturer: Kemet; ManufacturerPartNumber: C0603T104K5RALTU; Value: 100n/50V
TMP_IF_U1 = ADG708: CMOS Analog 8:1 Multiplexer; Manufacturer: Analog Devices; ManufacturerPartNumber: ADG708

## Sheet PLD_HK.SchDoc: RadFET
size A4; ApprovedBy: Piotr Kuligowski; CheckedBy: Michal Gumiela; Author: Grzegorz Gajoch; DocumentNumber: PWSat2-xxx-DW-xxx; Revision: 1; SheetTotal: 32; Model: DM1
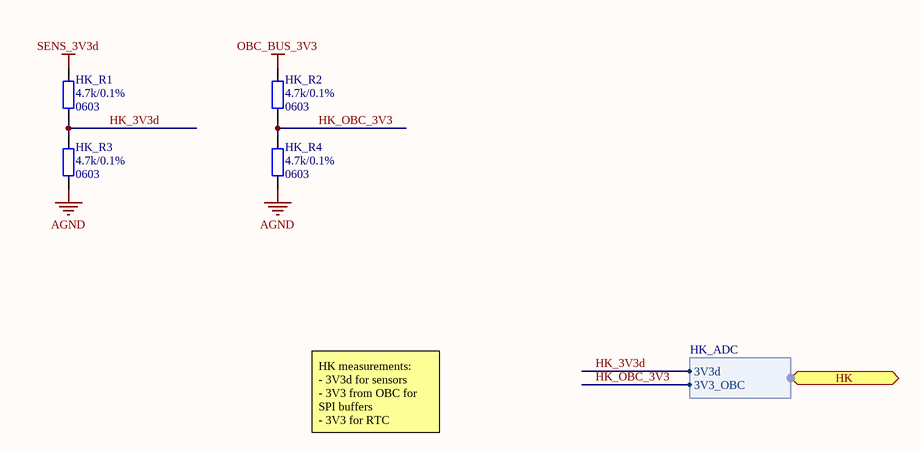
[diagram p23: PLD_HK.SchDoc]

### Parts
HK_R1  Package: 0603  [SMD_Resistor_0603]  (hidden comment: 4.7k/0.1%)
HK_R2  Package: 0603  [SMD_Resistor_0603]  (hidden comment: 4.7k/0.1%)
HK_R3  Package: 0603  [SMD_Resistor_0603]  (hidden comment: 4.7k/0.1%)
HK_R4  Package: 0603  [SMD_Resistor_0603]  (hidden comment: 4.7k/0.1%)

### Ports
HK (harness HK_ADC)

### Harnesses
HK_ADC: 3V3_OBC, 3V3d

### Nets
AGND: HK_R3.2 HK_R4.2
OBC_BUS_3V3: HK_R2.1
SENS_3V3d: HK_R1.1
HK_3V3d: HK_R1.2 HK_R3.1 ; port HK.3V3d  [project net HK_3V3]
HK_OBC_3V3: HK_R2.2 HK_R4.1 ; port HK.3V3_OBC  [project net HK_3V3_OBC]

### Notes on the sheet
- HK measurements:
  - 3V3d for sensors
  - 3V3 from OBC for SPI buffers
  - 3V3 for RTC
- Title:
- Project:
- Author:
- Model:
- Document Number:
- Checked by:
- Rev:
- Date:
- Approved by:
- Sheet:
- of
- File name:

### Library data of the parts
HK_R1-HK_R4 = Res: Value: 4.7k/0.1%

## Sheet PLD_ADC_MUX.SchDoc: RadFET
size A4; ApprovedBy: Piotr Kuligowski; CheckedBy: Michal Gumiela; Author: Grzegorz Gajoch; DocumentNumber: PWSat2-xxx-DW-xxx; Revision: 1; SheetTotal: 32; Model: DM1
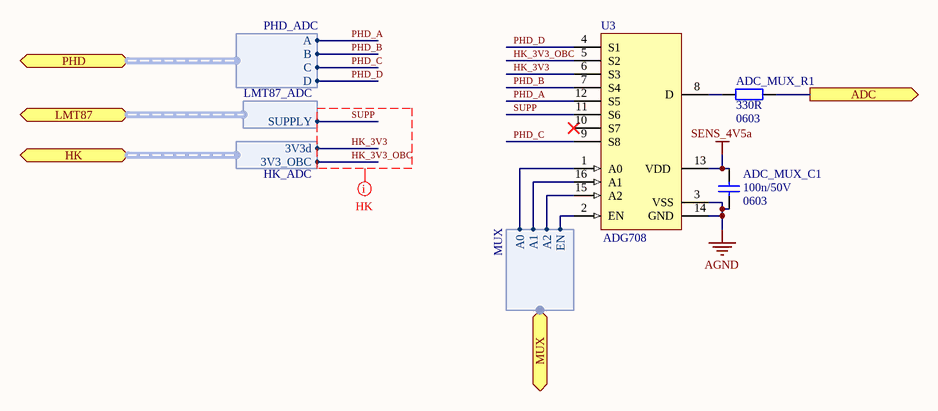
[diagram p24: PLD_ADC_MUX.SchDoc]

### Parts
ADC_MUX_C1  Package: 0603  [SMD_Capacitor_0603]  (hidden comment: 100n/50V)
ADC_MUX_R1  Package: 0603  [SMD_Resistor_0603]  (hidden comment: 330R)
U3  ADG708  [TSSOP16]

### Ports
ADC (out), HK (harness HK_ADC), LMT87 (harness LMT87_ADC), MUX (harness MUX), PHD (harness PHD_ADC)

### Harnesses
MUX: A0, A1, A2, EN
HK_ADC: 3V3_OBC, 3V3d
LMT87_ADC: SUPPLY
PHD_ADC: A, B, C, D

### Nets
AGND: ADC_MUX_C1.2 U3.3(VSS) U3.14(GND)
SENS_4V5a: ADC_MUX_C1.1 U3.13(VDD)
A0: U3.1(A0) ; port MUX.A0
A1: U3.16(A1) ; port MUX.A1
A2: U3.15(A2) ; port MUX.A2
EN: U3.2(EN) ; port MUX.EN
HK_3V3: U3.6(S3) ; port HK.3V3d
HK_3V3_OBC: U3.5(S2) ; port HK.3V3_OBC
PHD_A: U3.12(S5) ; port PHD.A  [project net OUT_A]
PHD_B: U3.7(S4) ; port PHD.B  [project net OUT_B]
PHD_C: U3.9(S8) ; port PHD.C  [project net OUT_C]
PHD_D: U3.4(S1) ; port PHD.D  [project net OUT_D]
SUPP: U3.11(S6) ; port LMT87.SUPPLY  [project net LMT87_SUPPLY]
NetADC_C7_1: ADC_MUX_R1.2 ; port ADC
NetADC_MUX_R1_1: ADC_MUX_R1.1 U3.8(D)

Not connected (* = marked no-connect by the designer): U3 10(S7)*

### Layout directives
net class HK: HK_3V3, HK_3V3_OBC, SUPP

### Notes on the sheet
- Title:
- Project:
- Author:
- Model:
- Document Number:
- Checked by:
- Rev:
- Date:
- Approved by:
- Sheet:
- of
- File name:

### Library data of the parts
ADC_MUX_C1 = Cer_C0603T104K5RALTU: Ceramic Cap Kemet COTS 100n/50V X7R 0603; Manufacturer: Kemet; ManufacturerPartNumber: C0603T104K5RALTU; Value: 100n/50V
ADC_MUX_R1 = Res: Value: 330R
U3 = ADG708: as TMP_IF_U1 on sheet PLD_Thermometers_PT1000; ManufacturerPartNumber: ADG708

## Sheet PLD_MemoryInterface.SchDoc: ADC for SunSref,Photodiodes and HK
size A4; ApprovedBy: Piotr Kuligowski; CheckedBy: Michal Gumiela; Author: Grzegorz Gajoch; DocumentNumber: PWSat2-xxx-DW-xxx; Revision: 1; SheetTotal: 32; Model: DM1
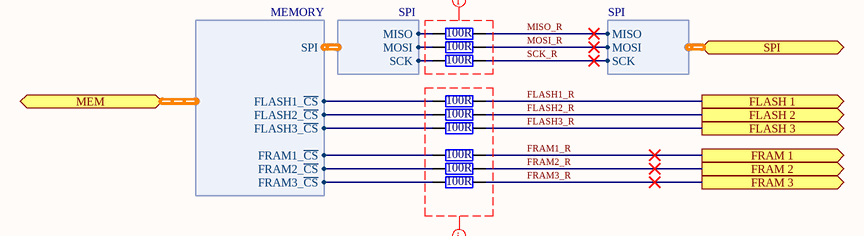
[diagram p25: PLD_MemoryInterface.SchDoc]

### Parts
MEM_R1  100R  [SMD_Resistor_0603]
MEM_R2  100R  [SMD_Resistor_0603]
MEM_R3  100R  [SMD_Resistor_0603]
MEM_R4  100R  [SMD_Resistor_0603]
MEM_R5  100R  [SMD_Resistor_0603]
MEM_R6  100R  [SMD_Resistor_0603]
MEM_R7  100R  [SMD_Resistor_0603]
MEM_R8  100R  [SMD_Resistor_0603]
MEM_R9  100R  [SMD_Resistor_0603]

### Ports
FLASH 1 (out), FLASH 2 (out), FLASH 3 (out), FRAM 1 (out), FRAM 2 (out), FRAM 3 (out), MEM (harness MEMORY), SPI (harness SPI)

### Harnesses
MEMORY: SPI, FLASH1_~{CS}, FRAM1_~{CS}, FLASH2_~{CS}, FLASH3_~{CS}, FRAM2_~{CS}, FRAM3_~{CS}
SPI: MISO, MOSI, SCK

### Nets
FLASH1_R: MEM_R4.2 ; port FLASH 1
FLASH2_R: MEM_R5.2 ; port FLASH 2
FLASH3_R: MEM_R6.2 ; port FLASH 3
FRAM1_R: MEM_R7.2 ; port FRAM 1
FRAM2_R: MEM_R8.2 ; port FRAM 2
FRAM3_R: MEM_R9.2 ; port FRAM 3
MISO_R: MEM_R1.2 ; port SPI.MISO
MOSI_R: MEM_R2.2 ; port SPI.MOSI
Piggyback_GPIO_PA8: MEM_R6.1 ; port MEM.FLASH3_~{CS}
Piggyback_GPIO_PA9: MEM_R9.1 ; port MEM.FRAM3_~{CS}
Piggyback_GPIO_PA10: MEM_R8.1 ; port MEM.FRAM2_~{CS}
Piggyback_GPIO_PA11: MEM_R5.1 ; port MEM.FLASH2_~{CS}
Piggyback_GPIO_PA12: MEM_R7.1 ; port MEM.FRAM1_~{CS}
Piggyback_GPIO_PA13: MEM_R4.1 ; port MEM.FLASH1_~{CS}
Piggyback_SPI-CLK_PE5: MEM_R3.1 ; harness SPI.SCK
Piggyback_SPI-MISO_PE6: MEM_R1.1 ; harness SPI.MISO
Piggyback_SPI-MOSI_PE7: MEM_R2.1 ; harness SPI.MOSI
SCK_R: MEM_R3.2 ; port SPI.SCK

### Layout directives
net class SPI: (no net found under the mark)
net class SPI_CS: (no net found under the mark)

### Notes on the sheet
- Title:
- Project:
- Author:
- Model:
- Document Number:
- Checked by:
- Rev:
- Date:
- Approved by:
- Sheet:
- of
- File name:

### Library data of the parts
MEM_R1-MEM_R9 = Res: Value: 100R; Package: 0603

## Sheet PLD_Connectors_PC-104.SchDoc: Connectors - PC-104
size A4; ApprovedBy: Piotr Kuligowski; CheckedBy: Michal Gumiela; Author: Grzegorz Gajoch; DocumentNumber: PWSat2-xxx-DW-xxx; Revision: 1; SheetTotal: 32; Model: DM1
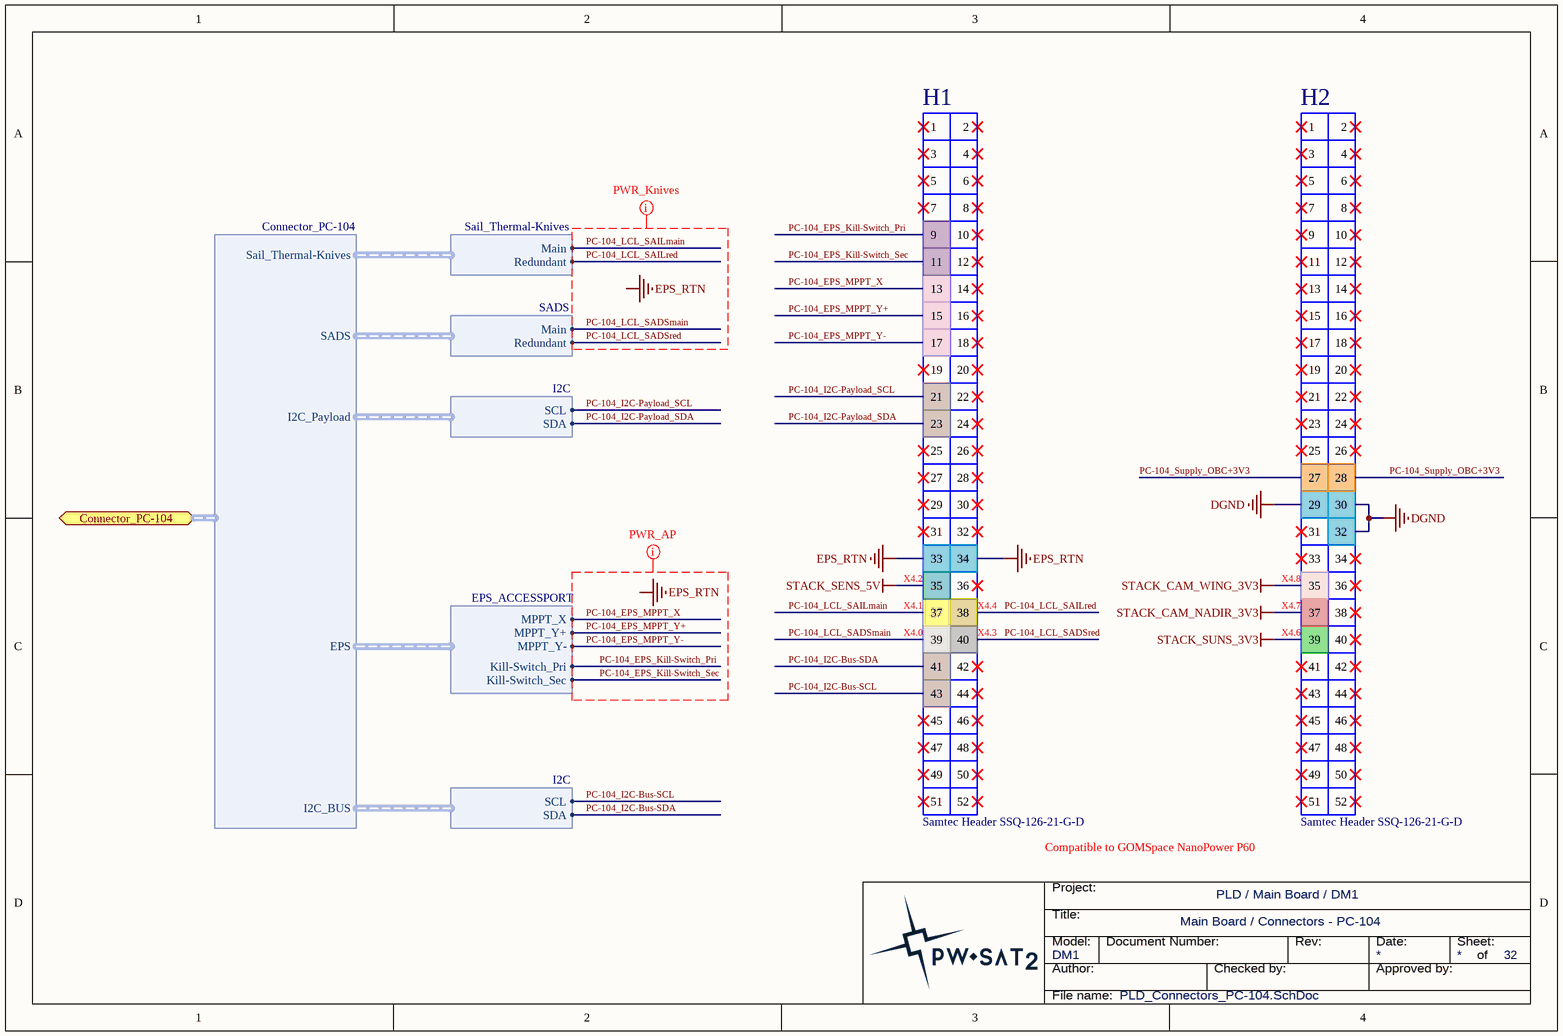
[diagram p26: PLD_Connectors_PC-104.SchDoc]

### Parts
H1  Samtec Header SSQ-126-21-G-D  [Samtec_SSQ-126-21-G-D]
H2  Samtec Header SSQ-126-21-G-D  [Samtec_SSQ-126-21-G-D]

### Ports
Connector_PC-104 (harness Connector_PC-104)

### Harnesses
Connector_PC-104: I2C_Payload, Sail_Thermal-Knives, SADS, I2C_BUS, EPS
Sail_Thermal-Knives: Main, Redundant
SADS: Main, Redundant
I2C: SDA, SCL
EPS_ACCESSPORT: MPPT_X, MPPT_Y+, MPPT_Y-, Kill-Switch_Pri, Kill-Switch_Sec

### Nets
DGND: H2.29 H2.30 H2.32
EPS_RTN: H1.33 H1.34
STACK_CAM_NADIR_3V3: H2.37
STACK_CAM_WING_3V3: H2.35
STACK_SENS_5V: H1.35
STACK_SUNS_3V3: H2.39
PC-104_EPS_Kill-Switch_Pri: H1.9 ; harness EPS_ACCESSPORT.Kill-Switch_Pri
PC-104_EPS_Kill-Switch_Sec: H1.11 ; harness EPS_ACCESSPORT.Kill-Switch_Sec
PC-104_EPS_MPPT_X: H1.13 ; harness EPS_ACCESSPORT.MPPT_X
PC-104_EPS_MPPT_Y+: H1.15 ; harness EPS_ACCESSPORT.MPPT_Y+
PC-104_EPS_MPPT_Y-: H1.17 ; harness EPS_ACCESSPORT.MPPT_Y-
PC-104_I2C-Bus-SCL: H1.43 ; harness I2C.SCL
PC-104_I2C-Bus-SDA: H1.41 ; harness I2C.SDA
PC-104_I2C-Payload_SCL: H1.21 ; harness I2C.SCL
PC-104_I2C-Payload_SDA: H1.23 ; harness I2C.SDA
PC-104_LCL_SADSmain: H1.39 ; harness SADS.Main
PC-104_LCL_SADSred: H1.40 ; harness SADS.Redundant
PC-104_LCL_SAILmain: H1.37 ; harness Sail_Thermal-Knives.Main
PC-104_LCL_SAILred: H1.38 ; harness Sail_Thermal-Knives.Redundant
PC-104_Supply_OBC+3V3: H2.27 H2.28

Not connected (* = marked no-connect by the designer): H1 1* 2* 3* 4* 5* 6* 7* 8* 10* 12* 14* 16* 18* 19* 20* 22* 24* 25* 26* 27* 28* 29* 30* 31* 32* 36* 42* 44* 45* 46* 47* 48* 49* 50* 51* 52*; H2 1* 2* 3* 4* 5* 6* 7* 8* 9* 10* 11* 12* 13* 14* 15* 16* 17* 18* 19* 20* 21* 22* 23* 24* 25* 26* 31* 33* 34* 36* 38* 40* 41* 42* 43* 44* 45* 46* 47* 48* 49* 50* 51* 52*

### Layout directives
net class PWR_Knives: EPS_RTN, PC-104_LCL_SADSmain, PC-104_LCL_SADSred, PC-104_LCL_SAILmain, PC-104_LCL_SAILred
net class PWR_AP: EPS_RTN, PC-104_EPS_Kill-Switch_Pri, PC-104_EPS_Kill-Switch_Sec, PC-104_EPS_MPPT_X, PC-104_EPS_MPPT_Y+, PC-104_EPS_MPPT_Y-

### Notes on the sheet
- (near H1) X4.2
- (near H2) X4.8
- (near H1) X4.1
- (near H1) X4.0
- (near H1) X4.4
- (near H1) X4.3
- (near H2) X4.7
- (near H2) X4.6
- Compatible to GOMSpace NanoPower P60
- Labels drawn without touching a wire or pin: EPS_RTN
- Title:
- Project:
- Author:
- Model:
- Document Number:
- Checked by:
- Rev:
- Date:
- Approved by:
- Sheet:
- of
- File name:

### Library data of the parts
H1 H2 = Samtec_SSQ-126-xx-x-D: Samtec SSQ Series Header , 2.54mm pitch, 2x26pin. PC-104 Stack Connector.; HelpUrl: http://suddendocs.samtec.com/catalog_english/ssq_th.pdf; Value: Samtec Header SSQ-126-21-G-D

## Sheet PLD_Connectors_Piggyback.SchDoc: Connectors - Piggyback
size A4; ApprovedBy: Piotr Kuligowski; CheckedBy: Michal Gumiela; Author: Grzegorz Gajoch; DocumentNumber: PWSat2-xxx-DW-xxx; Revision: 1; SheetTotal: 32; Model: DM1
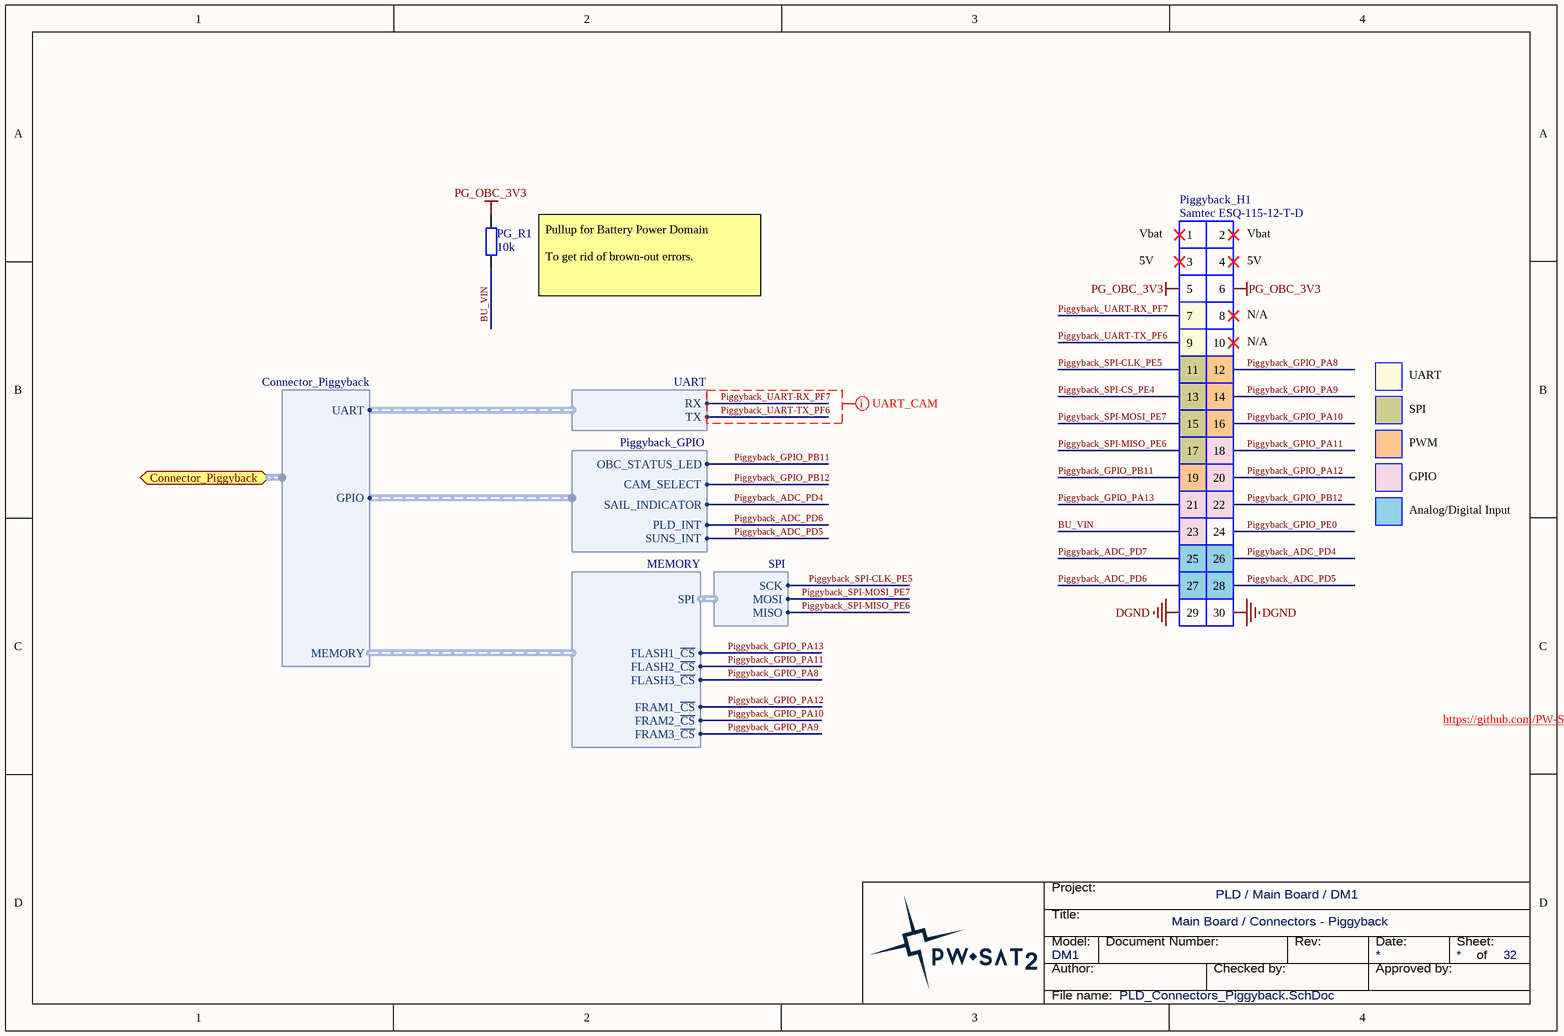
[diagram p27: PLD_Connectors_Piggyback.SchDoc]

### Parts
PG_R1  10k  [SMD_Resistor_0603]
Piggyback_H1  Samtec ESQ-115-12-T-D  [Samtec_ESQ-115-12-T-D]

### Ports
Connector_Piggyback (harness Connector_Piggyback)

### Harnesses
SPI: MISO, MOSI, SCK
UART: RX, TX
Connector_Piggyback: UART, GPIO, MEMORY
Piggyback_GPIO: CAM_SELECT, PLD_INT, SAIL_INDICATOR, SUNS_INT, OBC_STATUS_LED
MEMORY: SPI, FLASH1_~{CS}, FRAM1_~{CS}, FLASH2_~{CS}, FLASH3_~{CS}, FRAM2_~{CS}, FRAM3_~{CS}

### Nets
DGND: Piggyback_H1.29 Piggyback_H1.30
PG_OBC_3V3: PG_R1.2 Piggyback_H1.5 Piggyback_H1.6
BU_VIN: PG_R1.1 Piggyback_H1.23
Piggyback_ADC_PD4: Piggyback_H1.26 ; harness Piggyback_GPIO.SAIL_INDICATOR
Piggyback_ADC_PD5: Piggyback_H1.28 ; harness Piggyback_GPIO.SUNS_INT
Piggyback_ADC_PD6: Piggyback_H1.27 ; harness Piggyback_GPIO.PLD_INT  [project net INT]
Piggyback_ADC_PD7: Piggyback_H1.25
Piggyback_GPIO_PA8: Piggyback_H1.12 ; harness MEMORY.FLASH3_~{CS}
Piggyback_GPIO_PA9: Piggyback_H1.14 ; harness MEMORY.FRAM3_~{CS}
Piggyback_GPIO_PA10: Piggyback_H1.16 ; harness MEMORY.FRAM2_~{CS}
Piggyback_GPIO_PA11: Piggyback_H1.18 ; harness MEMORY.FLASH2_~{CS}
Piggyback_GPIO_PA12: Piggyback_H1.20 ; harness MEMORY.FRAM1_~{CS}
Piggyback_GPIO_PA13: Piggyback_H1.21 ; harness MEMORY.FLASH1_~{CS}
Piggyback_GPIO_PB11: Piggyback_H1.19 ; harness Piggyback_GPIO.OBC_STATUS_LED  [project net OBC_STATUS_LED]
Piggyback_GPIO_PB12: Piggyback_H1.22 ; harness Piggyback_GPIO.CAM_SELECT
Piggyback_GPIO_PE0: Piggyback_H1.24
Piggyback_SPI-CLK_PE5: Piggyback_H1.11 ; harness SPI.SCK
Piggyback_SPI-CS_PE4: Piggyback_H1.13
Piggyback_SPI-MISO_PE6: Piggyback_H1.17 ; harness SPI.MISO
Piggyback_SPI-MOSI_PE7: Piggyback_H1.15 ; harness SPI.MOSI
Piggyback_UART-RX_PF7: Piggyback_H1.7 ; harness UART.RX
Piggyback_UART-TX_PF6: Piggyback_H1.9 ; harness UART.TX

Not connected (* = marked no-connect by the designer): Piggyback_H1 1* 2* 3* 4* 8* 10*

### Layout directives
net class UART_CAM: Piggyback_UART-RX_PF7, Piggyback_UART-TX_PF6

### Notes on the sheet
- (near Piggyback_H1) Vbat
- (near PG_R1) Pullup for Battery Power Domain
  To get rid of brown-out errors.
- (near Piggyback_H1) 5V
- (near Piggyback_H1) N/A
- UART
- SPI
- PWM
- GPIO
- Analog/Digital Input
- https://github.com/PW-Sat2/Documentation/raw/master/obc/obc_datasheet_esl_cubecomputer.pdf
- Title:
- Project:
- Author:
- Model:
- Document Number:
- Checked by:
- Rev:
- Date:
- Approved by:
- Sheet:
- of
- File name:

### Library data of the parts
PG_R1 = Res: Value: 10k; Package: 0603
Piggyback_H1 = Samtec_ESQ-115-xx-x-D: Samtec ESQ Series Header , 2.54mm pitch, 2x15pin. PC-104 Stack Connector.; HelpUrl: http://suddendocs.samtec.com/catalog_english/esq_th.pdf; Value: Samtec ESQ-115-12-T-D

## Nets that join several sheets
AGND: PLD_Connectors (13 pins), PLD_Top (SADS_RTD1.1), PLD_RadFET (RF_J1.1), PLD_RadFET_Current_Source (RF_C8.2 RF_U4.2), PLD_Photodiodes (7 pins), PLD_SunSref-Interface (5 pins), PLD_ADC (12 pins), PLD_Local-Supply (15 pins), PLD_LMT87 (TMP_LMT_C1.2 U1.2), PLD_Thermometers_PT1000 (TMP_IF_C1.2 TMP_IF_U1.3 TMP_IF_U1.14), PLD_HK (HK_R3.2 HK_R4.2), PLD_ADC_MUX (ADC_MUX_C1.2 U3.3 U3.14)
CAM_nadir_3V3: PLD_Connectors (CONN_H5.2), PLD_Local-Supply (SUPP_C14.1 SUPP_C15.1 SUPP_FB4.2)
CAM_wing_3V3: PLD_Connectors (CONN_H3.2), PLD_Local-Supply (SUPP_C8.1 SUPP_C9.1 SUPP_FB2.2)
DGND: PLD_Connectors (15 pins), PLD_Top (OBC_D1.2), PLD_RTC (5 pins), PLD_RadFET_Supply (RF_R13.1), PLD Top/RadFET/Radfet Supply/LCL 3V3d (RF_C22_LCL_3V3d.2 RF_R19_LCL_3V3d.1 RF_R20_LCL_3V3d.1 RF_U9_LCL_3V3d.2), PLD_RadFET_ADC (6 pins), PLD_Sail_interface (LI_C1.1), PLD_Sensors_AVR_Interface (16 pins), PLD_AVR_Watchdog (RF_C20.2 RF_C21.2 RF_R22.1 RF_U10.2), PLD_ADC (6 pins), PLD Top/I2C Repeater for PLD (6 pins), PLD_Gyroscopes (9 pins), PLD_Local-Supply (29 pins), PLD Top/I2C Repeater for RTC (6 pins), PLD Top/I2C Repeater for SunS (6 pins), PLD Top/I2C Repeater for Gyro (6 pins), PLD_Connectors_PC-104 (H2.29 H2.30 H2.32), PLD_Connectors_Piggyback (Piggyback_H1.29 Piggyback_H1.30)
EPS_RTN: PLD_Connectors (CONN_H2.2 CONN_H2.6 CONN_H8.1 CONN_H9.1), PLD_Connectors_PC-104 (H1.33 H1.34)
OBC_BUS_3V3: PLD_RTC (RTC_D1.A), PLD_Sail_interface (LI_R2.1), PLD_Local-Supply (SUPP_C26.2 SUPP_U4.6), PLD_HK (HK_R2.1), PLD Top/I2C Repeater for RTC (8 pins)
OBC_PLD_3V3: PLD Top/I2C Repeater for PLD (I5_I2C_Repeater_for_PLD.1 I11_I2C_Repeater_for_PLD.2 I12_I2C_Repeater_for_PLD.2), PLD_Gyroscopes (Gyro_C3.1 Gyro_FB1.1 Gyro_U1.8), PLD_Local-Supply (SUPP_C16.2 SUPP_U3.6), PLD Top/I2C Repeater for SunS (I5_I2C_Repeater_for_SunS.1 I11_I2C_Repeater_for_SunS.2 I12_I2C_Repeater_for_SunS.2), PLD Top/I2C Repeater for Gyro (8 pins)
PG_OBC_3V3: PLD_Local-Supply (SUPP_FB5.1 SUPP_FB9.1), PLD_Connectors_Piggyback (PG_R1.2 Piggyback_H1.5 Piggyback_H1.6)
RAD_3V3d: PLD Top/RadFET/Radfet Supply/LCL 3V3d (RF_R20_LCL_3V3d.2 RF_U9_LCL_3V3d.6), PLD_RadFET_ADC (10 pins)
RAD_4V5a: PLD_RadFET_Supply (6 pins), PLD_RadFET_ADC (5 pins), PLD_RadFET_Current_Source (RF_C8.1 RF_R3.1 RF_U4.5), PLD_RadFET_Mux (RF_C10.1 RF_U6.14), PLD_RadFET_Sensor (8 pins)
RF_5V: PLD Top/RadFET/Radfet Supply/LCL 5V (RF_U9_LCL_5V.1), PLD_Local-Supply (SUPP_C24.1 SUPP_C25.2 SUPP_FB8.2)
RF_AGND: PLD_RadFET (RF_J1.2), PLD_RadFET_Supply (10 pins), PLD Top/RadFET/Radfet Supply/LCL 5V (RF_C22_LCL_5V.2 RF_R19_LCL_5V.1 RF_R20_LCL_5V.1 RF_U9_LCL_5V.2), PLD_RadFET_ADC (7 pins), PLD_RadFET_Current_Source (RF_C9.1), PLD_RadFET_Mux (RF_C10.2 RF_U6.3 RF_U6.9 RF_U6.15), PLD_RadFET_Sensor (RF_C11.2 RF_U8.3 RF_U8.6), PLD_RadFET_Differential_Lowpass (RF_C17.1 RF_C19.2)
SENS_3V3d: PLD Top/RadFET/Radfet Supply/LCL 3V3d (RF_U9_LCL_3V3d.1), PLD_Sensors_AVR_Interface (19 pins), PLD_AVR_Watchdog (RF_C20.1 RF_R21.2 RF_U10.4), PLD_ADC (5 pins), PLD Top/I2C Repeater for PLD (5 pins), PLD_Local-Supply (SUPP_C10.1 SUPP_C13.1 SUPP_R10.1 SUPP_U2.4), PLD_HK (HK_R1.1)
SENS_4V1a: PLD_Photodiodes (PHD_R6.1), PLD_ADC (ADC_C5.1 ADC_C10.1 ADC_U1.2), PLD_Local-Supply (5 pins)
SENS_4V5a: PLD_Photodiodes (PHD_C5.1 PHD_C6.2 PHD_U1.4), PLD_Local-Supply (5 pins), PLD_LMT87 (TMP_LMT_R1.2), PLD_Thermometers_PT1000 (TMP_IF_C1.1 TMP_IF_U1.13), PLD_ADC_MUX (ADC_MUX_C1.1 U3.13)
STACK_CAM_NADIR_3V3: PLD_Local-Supply (SUPP_FB4.1), PLD_Connectors_PC-104 (H2.37)
STACK_CAM_WING_3V3: PLD_Local-Supply (SUPP_FB2.1), PLD_Connectors_PC-104 (H2.35)
STACK_SENS_5V: PLD_Local-Supply (SUPP_FB1.1 SUPP_FB3.1 SUPP_FB7.1 SUPP_FB8.1), PLD_Connectors_PC-104 (H1.35)
STACK_SUNS_3V3: PLD_Local-Supply (SUPP_FB6.1), PLD_Connectors_PC-104 (H2.39)
SunS_3V3: PLD_Connectors (CONN_H10.4), PLD_Local-Supply (SUPP_C19.1 SUPP_C20.1 SUPP_FB6.2), PLD Top/I2C Repeater for SunS (5 pins)
SunSref_5V: PLD_Connectors (CONN_H1.3), PLD_Local-Supply (SUPP_C7.1 SUPP_C23.2 SUPP_FB7.2)
A0: PLD_Sensors_AVR_Interface (AVR_U1.42 MCU_R5.2), PLD_Thermometers_PT1000 (TMP_IF_U1.1), PLD_ADC_MUX (U3.1)
A1: PLD_Sensors_AVR_Interface (AVR_U1.40 MCU_R6.2), PLD_Thermometers_PT1000 (TMP_IF_U1.16), PLD_ADC_MUX (U3.16)
A2: PLD_Sensors_AVR_Interface (AVR_U1.41 MCU_R7.2), PLD_Thermometers_PT1000 (TMP_IF_U1.15), PLD_ADC_MUX (U3.15)
AD7714_~{CS}: PLD_RadFET_ADC (RF_R27.1), PLD_Sensors_AVR_Interface (AVR_U1.33)
AD7714_DRDY: PLD_RadFET_ADC (RF_R26.1), PLD_Sensors_AVR_Interface (AVR_U1.32)
ADC128_~{CS}: PLD_Sensors_AVR_Interface (AVR_U1.9 MCU_R1.2), PLD_ADC (ADC_R3.2)
C_DIODE_0-2: PLD_RadFET_Mux (RF_U6.4 RF_U6.13), PLD_RadFET_Sensor (RF_U7.8)
C_MOS_0: PLD_RadFET_Mux (RF_U6.6 RF_U6.11), PLD_RadFET_Sensor (RF_Q1.2 RF_R16.1 RF_U7.6 RF_U7.13)
C_MOS_1: PLD_RadFET_Mux (RF_U6.7 RF_U6.10), PLD_RadFET_Sensor (RF_Q2.2 RF_R17.1 RF_U7.1 RF_U7.3)
C_MOS_2: PLD_RadFET_Mux (RF_U6.5 RF_U6.12), PLD_RadFET_Sensor (RF_Q3.2 RF_R18.1 RF_U7.10 RF_U7.12)
EN: PLD_Sensors_AVR_Interface (AVR_U1.43 MCU_R8.2), PLD_Thermometers_PT1000 (TMP_IF_U1.2), PLD_ADC_MUX (U3.2)
HK_3V3: PLD_HK (HK_R1.2 HK_R3.1), PLD_ADC_MUX (U3.6)
HK_3V3_OBC: PLD_HK (HK_R2.2 HK_R4.1), PLD_ADC_MUX (U3.5)
IN_A: PLD_Connectors (CONN_H6.7), PLD_Photodiodes (PHD_C1.1 PHD_R3.1 PHD_U1.2)
IN_B: PLD_Connectors (CONN_H4.8), PLD_Photodiodes (PHD_C2.1 PHD_R2.1 PHD_U1.11)
IN_C: PLD_Connectors (CONN_H6.5), PLD_Photodiodes (PHD_C3.1 PHD_R4.1 PHD_U1.6)
IN_D: PLD_Connectors (CONN_H4.6), PLD_Photodiodes (PHD_C4.1 PHD_R1.1 PHD_U1.15)
INT: PLD_Sensors_AVR_Interface (AVR_U1.10 MCU_R13.1), PLD_Connectors_Piggyback (Piggyback_H1.27)
JFET_CURRENT: PLD_RadFET_Current_Source (RF_R5.2 RF_U4.3), PLD_RadFET_Sensor (RF_J3.1 RF_Q1.1 RF_Q2.1 RF_Q3.1)
LMT87_SUPPLY: PLD_LMT87 (TMP_LMT_R2.2), PLD_ADC_MUX (U3.11)
MISO: PLD_Sensors_AVR_Interface (AVR_U1.1 MCU_R2.2), PLD_ADC (ADC_R2.2)
MOSI: PLD_Sensors_AVR_Interface (AVR_U1.2 MCU_R3.2), PLD_ADC (ADC_R1.2)
MSCK: PLD_RadFET_ADC (RF_R1.1), PLD_Sensors_AVR_Interface (AVR_U1.26)
NetADC_C1_1: PLD_SunSref-Interface (SunSref_R1.2 SunSref_R2.2), PLD_ADC (ADC_C1.1 ADC_U1.4)
NetADC_C2_1: PLD_SunSref-Interface (SunSref_R9.2 SunSref_R10.2), PLD_ADC (ADC_C2.1 ADC_U1.5)
NetADC_C3_1: PLD_SunSref-Interface (SunSref_R3.2 SunSref_R4.2), PLD_ADC (ADC_C3.1 ADC_U1.6)
NetADC_C4_1: PLD_SunSref-Interface (SunSref_R7.2 SunSref_R8.2), PLD_ADC (ADC_C4.1 ADC_U1.7)
NetADC_C6_1: PLD_SunSref-Interface (SunSref_R5.2 SunSref_R6.2), PLD_ADC (ADC_C6.1 ADC_U1.8)
NetADC_C7_1: PLD_ADC (ADC_C7.1 ADC_U1.9), PLD_ADC_MUX (ADC_MUX_R1.2)
NetCONN_H1_1: PLD_Connectors (CONN_H1.1), PLD_SunSref-Interface (SunSref_R7.1)
NetCONN_H1_2: PLD_Connectors (CONN_H1.2), PLD_SunSref-Interface (SunSref_R5.1)
NetCONN_H1_4: PLD_Connectors (CONN_H1.4), PLD_SunSref-Interface (SunSref_R1.1)
NetCONN_H1_6: PLD_Connectors (CONN_H1.6), PLD_SunSref-Interface (SunSref_R3.1)
NetCONN_H1_7: PLD_Connectors (CONN_H1.7), PLD_SunSref-Interface (SunSref_R9.1)
NetCONN_H2_4: PLD_Connectors (CONN_H2.4), PLD_Sail_interface (LI_R1.1 LI_R2.2)
NetCONN_H3_6: PLD_Connectors (CONN_H3.6), PLD_Thermometers_PT1000 (TMP_IF_U1.5)
NetCONN_H4_5: PLD_Connectors (CONN_H4.5), PLD_Thermometers_PT1000 (TMP_IF_U1.10)
NetCONN_H4_7: PLD_Connectors (CONN_H4.7), PLD_Thermometers_PT1000 (TMP_IF_U1.11)
NetCONN_H5_6: PLD_Connectors (CONN_H5.6), PLD_Thermometers_PT1000 (TMP_IF_U1.12)
NetCONN_H6_6: PLD_Connectors (CONN_H6.6), PLD_Thermometers_PT1000 (TMP_IF_U1.7)
NetCONN_H6_8: PLD_Connectors (CONN_H6.8), PLD_Thermometers_PT1000 (TMP_IF_U1.6)
NetCONN_H10_5: PLD_Connectors (CONN_H10.5), PLD Top/I2C Repeater for SunS (I6_I2C_Repeater_for_SunS.1)
NetCONN_H10_6: PLD_Connectors (CONN_H10.6), PLD Top/I2C Repeater for SunS (I3_I2C_Repeater_for_SunS.1)
NetGyro_U1_23: PLD_Gyroscopes (Gyro_U1.23), PLD Top/I2C Repeater for Gyro (I3_I2C_Repeater_for_Gyro.1)
NetGyro_U1_24: PLD_Gyroscopes (Gyro_U1.24), PLD Top/I2C Repeater for Gyro (I6_I2C_Repeater_for_Gyro.1)
NetI3_I2C_Repeater_for_RTC_1: PLD_RTC (RTC_U1.6), PLD Top/I2C Repeater for RTC (I3_I2C_Repeater_for_RTC.1)
NetI6_I2C_Repeater_for_RTC_1: PLD_RTC (RTC_U1.5), PLD Top/I2C Repeater for RTC (I6_I2C_Repeater_for_RTC.1)
NetRF_C17_2: PLD_RadFET_ADC (RF_U1.9), PLD_RadFET_Differential_Lowpass (RF_C17.2 RF_C18.1 RF_R14.2)
NetRF_C18_2: PLD_RadFET_ADC (RF_U1.10), PLD_RadFET_Differential_Lowpass (RF_C18.2 RF_C19.1 RF_R15.2)
NetRF_FB1_2: PLD_RadFET_Supply (RF_FB1.2), PLD Top/RadFET/Radfet Supply/LCL 5V (RF_R20_LCL_5V.2 RF_U9_LCL_5V.6)
NetRF_J2_1: PLD_RadFET_Sensor (RF_J2.1), PLD_RadFET_Differential_Lowpass (RF_R14.1)
NetRF_R15_1: PLD_RadFET_Mux (RF_U6.8), PLD_RadFET_Differential_Lowpass (RF_R15.1)
OBC_STATUS_LED: PLD_Top (OBC_R1.2), PLD_Connectors_Piggyback (Piggyback_H1.19)
OUT_A: PLD_Photodiodes (PHD_C1.2 PHD_R3.2 PHD_U1.1), PLD_ADC_MUX (U3.12)
OUT_B: PLD_Photodiodes (PHD_C2.2 PHD_R2.2 PHD_U1.10), PLD_ADC_MUX (U3.7)
OUT_C: PLD_Photodiodes (PHD_C3.2 PHD_R4.2 PHD_U1.7), PLD_ADC_MUX (U3.9)
OUT_D: PLD_Photodiodes (PHD_C4.2 PHD_R1.2 PHD_U1.16), PLD_ADC_MUX (U3.4)
PC-104_I2C-Payload_SCL: PLD Top/I2C Repeater for PLD (I4_I2C_Repeater_for_PLD.2), PLD Top/I2C Repeater for RTC (I4_I2C_Repeater_for_RTC.2), PLD Top/I2C Repeater for SunS (I4_I2C_Repeater_for_SunS.2), PLD Top/I2C Repeater for Gyro (I4_I2C_Repeater_for_Gyro.2), PLD_Connectors_PC-104 (H1.21)
PC-104_I2C-Payload_SDA: PLD Top/I2C Repeater for PLD (I7_I2C_Repeater_for_PLD.2), PLD Top/I2C Repeater for RTC (I7_I2C_Repeater_for_RTC.2), PLD Top/I2C Repeater for SunS (I7_I2C_Repeater_for_SunS.2), PLD Top/I2C Repeater for Gyro (I7_I2C_Repeater_for_Gyro.2), PLD_Connectors_PC-104 (H1.23)
PC-104_LCL_SADSmain: PLD_Connectors (CONN_H8.2), PLD_Connectors_PC-104 (H1.39)
PC-104_LCL_SADSred: PLD_Connectors (CONN_H9.2), PLD_Connectors_PC-104 (H1.40)
PC-104_LCL_SAILmain: PLD_Connectors (CONN_H2.5), PLD_Connectors_PC-104 (H1.37)
PC-104_LCL_SAILred: PLD_Connectors (CONN_H2.1), PLD_Connectors_PC-104 (H1.38)
Piggyback_ADC_PD4: PLD_Sail_interface (LI_C1.2 LI_R1.2), PLD_Connectors_Piggyback (Piggyback_H1.26)
Piggyback_ADC_PD5: PLD_Connectors (CONN_H10.3), PLD_Connectors_Piggyback (Piggyback_H1.28)
Piggyback_GPIO_PA8: PLD_MemoryInterface (MEM_R6.1), PLD_Connectors_Piggyback (Piggyback_H1.12)
Piggyback_GPIO_PA9: PLD_MemoryInterface (MEM_R9.1), PLD_Connectors_Piggyback (Piggyback_H1.14)
Piggyback_GPIO_PA10: PLD_MemoryInterface (MEM_R8.1), PLD_Connectors_Piggyback (Piggyback_H1.16)
Piggyback_GPIO_PA11: PLD_MemoryInterface (MEM_R5.1), PLD_Connectors_Piggyback (Piggyback_H1.18)
Piggyback_GPIO_PA12: PLD_MemoryInterface (MEM_R7.1), PLD_Connectors_Piggyback (Piggyback_H1.20)
Piggyback_GPIO_PA13: PLD_MemoryInterface (MEM_R4.1), PLD_Connectors_Piggyback (Piggyback_H1.21)
Piggyback_SPI-CLK_PE5: PLD_MemoryInterface (MEM_R3.1), PLD_Connectors_Piggyback (Piggyback_H1.11)
Piggyback_SPI-MISO_PE6: PLD_MemoryInterface (MEM_R1.1), PLD_Connectors_Piggyback (Piggyback_H1.17)
Piggyback_SPI-MOSI_PE7: PLD_MemoryInterface (MEM_R2.1), PLD_Connectors_Piggyback (Piggyback_H1.15)
PT1000_SADS: PLD_Top (SADS_RTD1.2), PLD_Thermometers_PT1000 (TMP_IF_U1.9)
PT1000_SAIL: PLD_Connectors (CONN_H2.8), PLD_Thermometers_PT1000 (TMP_IF_U1.4)
~{RST}: PLD_Sensors_AVR_Interface (AVR_C6.1 AVR_P1.6 AVR_U1.4 R1.2), PLD_AVR_Watchdog (RF_U10.6)
RadFET_EN: PLD_RadFET_Supply (RF_R13.2), PLD Top/RadFET/Radfet Supply/LCL 5V (RF_R9_LCL_5V.2), PLD Top/RadFET/Radfet Supply/LCL 3V3d (RF_R9_LCL_3V3d.2), PLD_Sensors_AVR_Interface (AVR_U1.35)
RadFET_MISO: PLD_RadFET_ADC (RF_R25.1), PLD_Sensors_AVR_Interface (AVR_U1.31)
RadFET_MOSI: PLD_RadFET_ADC (RF_R2.1), PLD_Sensors_AVR_Interface (AVR_U1.30)
RadFET_MUX_A0: PLD_RadFET_Mux (RF_R24.1), PLD_Sensors_AVR_Interface (AVR_U1.14)
RadFET_MUX_A1: PLD_RadFET_Mux (RF_R6.1), PLD_Sensors_AVR_Interface (AVR_U1.12)
RadFET_MUX_EN: PLD_RadFET_Mux (RF_R23.1), PLD_Sensors_AVR_Interface (AVR_U1.13)
RadFET_Temp_MUX: PLD_RadFET_Sensor (RF_R7.1), PLD_Sensors_AVR_Interface (AVR_U1.25)
SCK: PLD_Sensors_AVR_Interface (AVR_U1.3 MCU_R4.2), PLD_ADC (ADC_R6.2)
SCL: PLD_Sensors_AVR_Interface (AVR_U1.19), PLD Top/I2C Repeater for PLD (I3_I2C_Repeater_for_PLD.1)
SDA: PLD_Sensors_AVR_Interface (AVR_U1.20), PLD Top/I2C Repeater for PLD (I6_I2C_Repeater_for_PLD.1)
WDG: PLD_Sensors_AVR_Interface (AVR_U1.44), PLD_AVR_Watchdog (RF_U10.1)